# EAGLE design tarjeta-v8 (EAGLE 6.4)
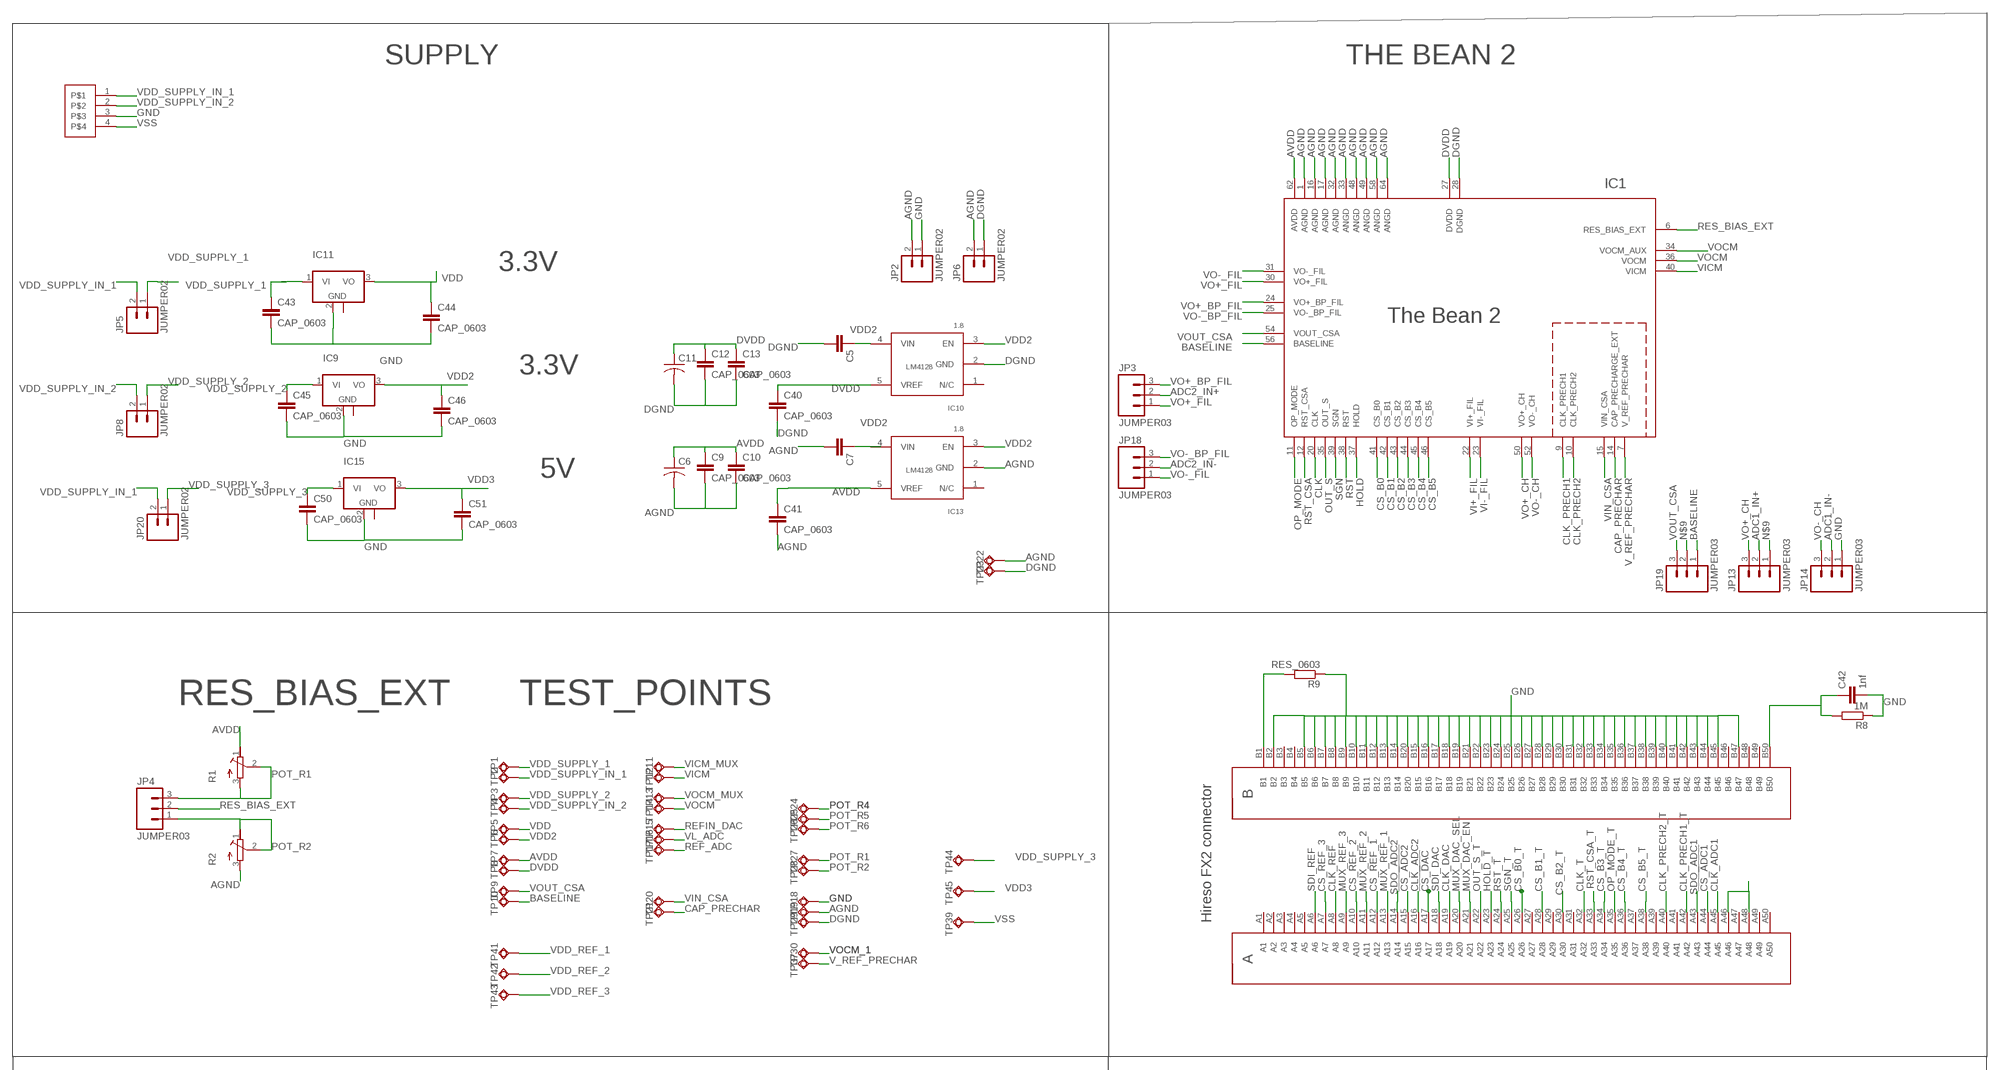
[diagram p0: schematic, sheet 1, part 1 of 3]
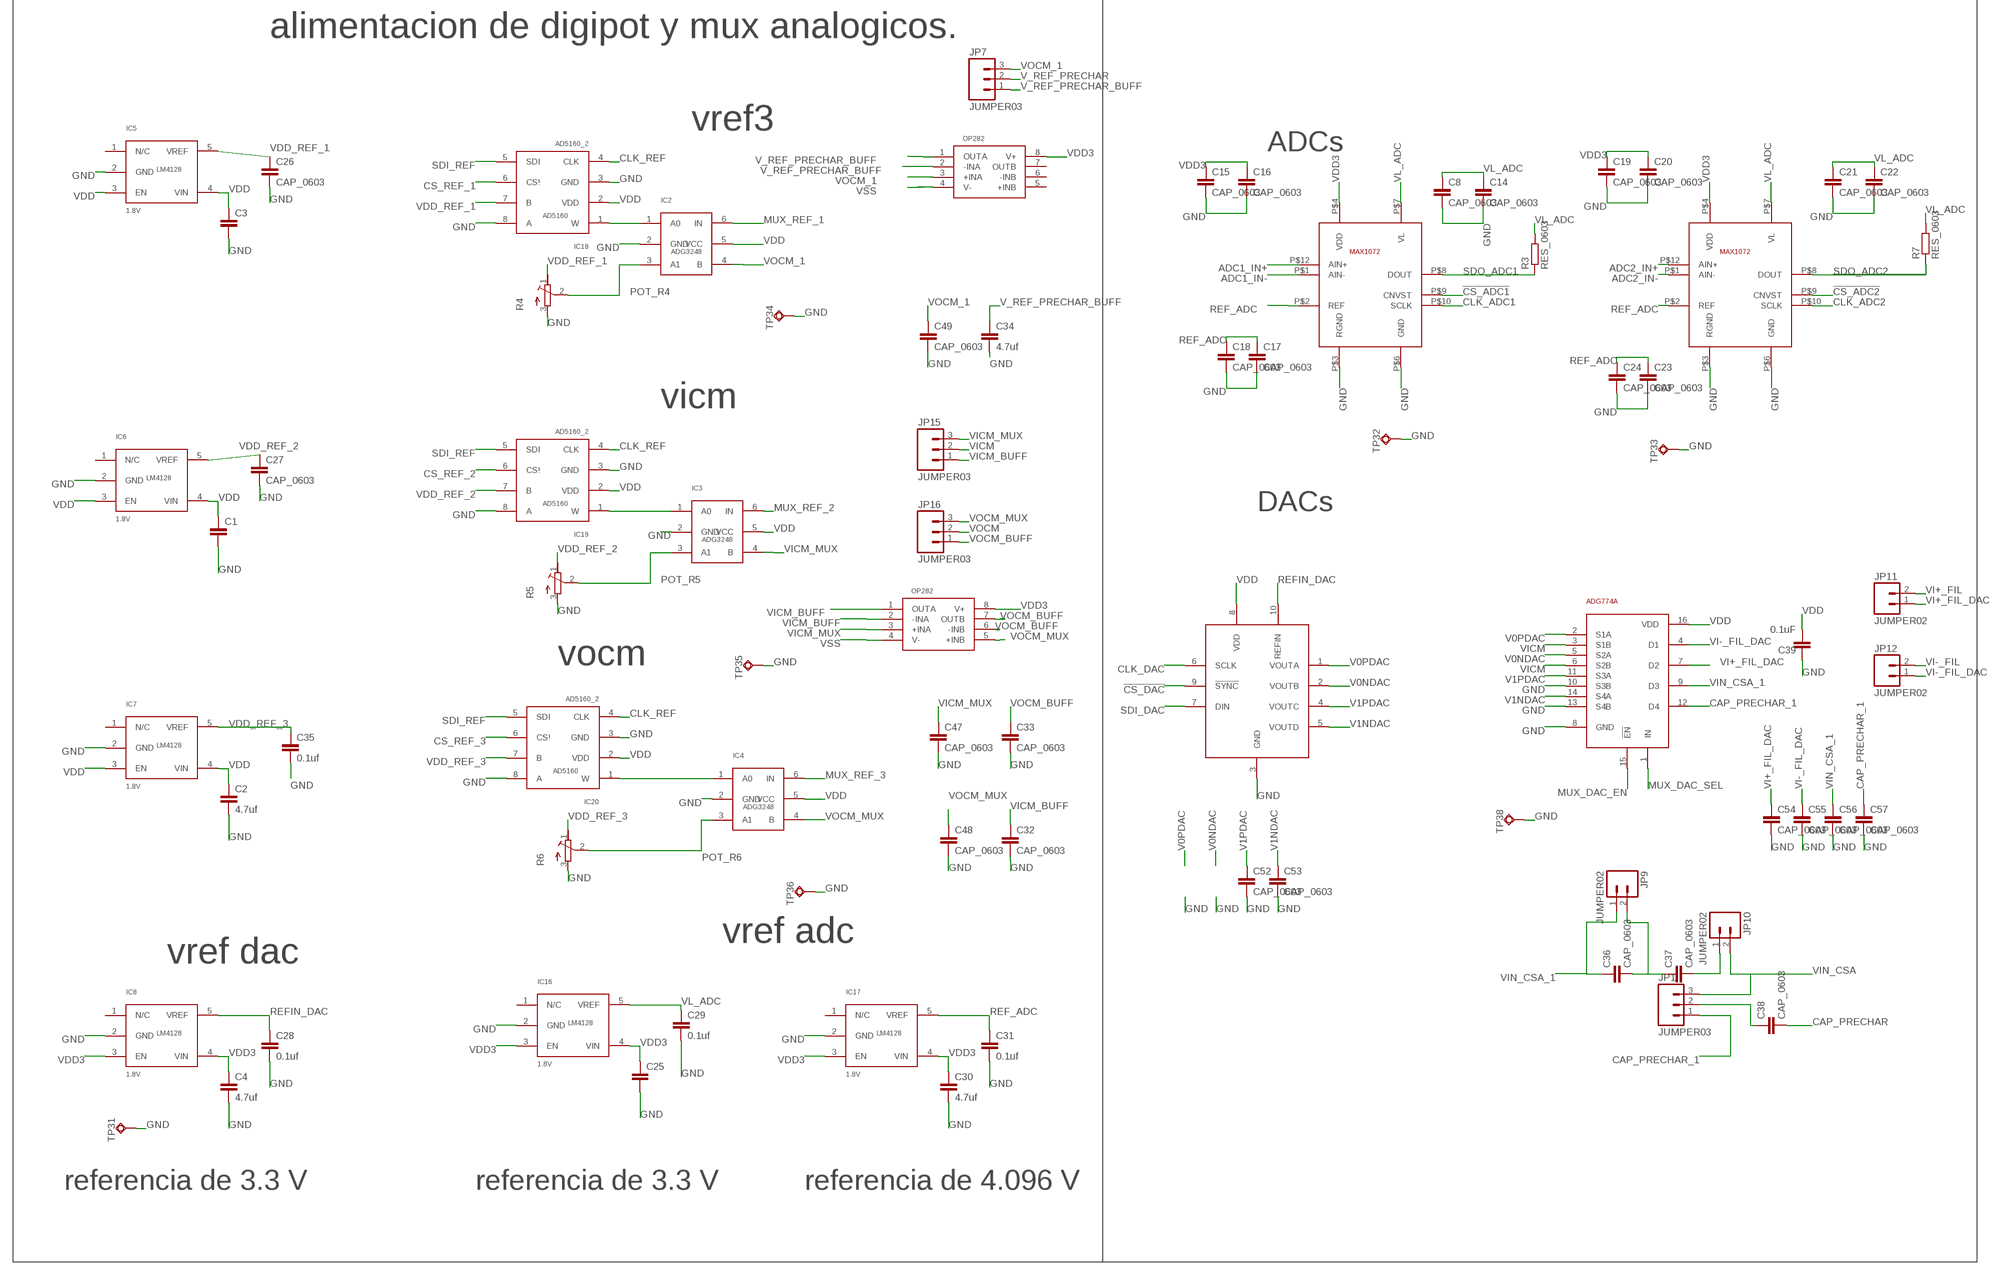
[diagram p1: schematic, sheet 1, part 2 of 3]
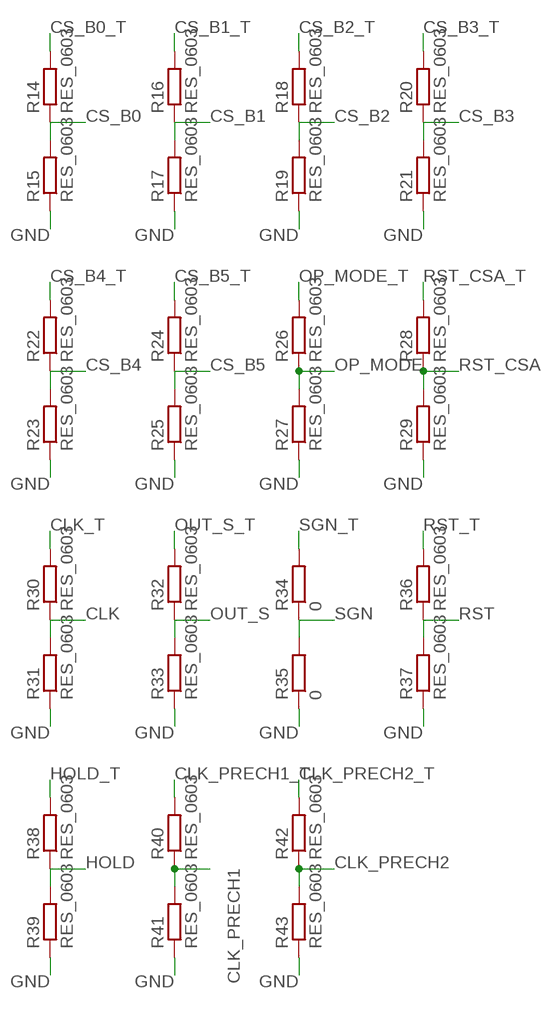
[diagram p2: schematic, sheet 1, part 3 of 3]

## Parts
C1  CAP_0402  [C0402]
C2  4.7uf  CAP_0402  [C0402]
C3  CAP_0402  [C0402]
C4  4.7uf  CAP_0402  [C0402]
C5  CAP_0402  [C0402]
C6  CAP_0805  [C0805]
C7  CAP_0402  [C0402]
C8  CAP_0603  [C0603]
C9  CAP_0603  [C0603]
C10  CAP_0603  [C0603]
C11  CAP_0805  [C0805]
C12  CAP_0603  [C0603]
C13  CAP_0603  [C0603]
C14  CAP_0603  [C0603]
C15  CAP_0603  [C0603]
C16  CAP_0603  [C0603]
C17  CAP_0603  [C0603]
C18  CAP_0603  [C0603]
C19  CAP_0603  [C0603]
C20  CAP_0603  [C0603]
C21  CAP_0603  [C0603]
C22  CAP_0603  [C0603]
C23  CAP_0603  [C0603]
C24  CAP_0603  [C0603]
C25  CAP_0402  [C0402]
C26  CAP_0603  [C0603]
C27  CAP_0603  [C0603]
C28  0.1uf  CAP_0603  [C0603]
C29  0.1uf  CAP_0603  [C0603]
C30  4.7uf  CAP_0402  [C0402]
C31  0.1uf  CAP_0603  [C0603]
C32  CAP_0603  [C0603]
C33  CAP_0603  [C0603]
C34  4.7uf  CAP_0603  [C0603]
C35  0.1uf  CAP_0603  [C0603]
C36  CAP_0603  [C0603]
C37  CAP_0603  [C0603]
C38  CAP_0603  [C0603]
C39  0.1uF  CAP_0603  [C0603]
C40  CAP_0603  [C0603]
C41  CAP_0603  [C0603]
C42  1nf  CAP_0603  [C0603]
C43  CAP_0603  [C0603]
C44  CAP_0603  [C0603]
C45  CAP_0603  [C0603]
C46  CAP_0603  [C0603]
C47  CAP_0603  [C0603]
C48  CAP_0603  [C0603]
C49  CAP_0603  [C0603]
C50  CAP_0603  [C0603]
C51  CAP_0603  [C0603]
C52  CAP_0603  [C0603]
C53  CAP_0603  [C0603]
C54  CAP_0603  [C0603]
C55  CAP_0603  [C0603]
C56  CAP_0603  [C0603]
C57  CAP_0603  [C0603]
IC1  THE_BEAN_2  [QFN64]
IC2  ADG3248  [SC70]
IC3  ADG3248  [SC70]
IC4  ADG3248  [SC70]
IC5  1.8V  LM4128_2  [SOT23-5L_2]
IC6  1.8V  LM4128_2  [SOT23-5L_2]
IC7  1.8V  LM4128_2  [SOT23-5L_2]
IC8  1.8V  LM4128_2  [SOT23-5L_2]
IC9  UA78M33DCY  [SOT223]
IC10  1.8  LM4128_2  [SOT23-5L_2]
IC11  UA78M33DCY  [SOT223]
IC12  OP282  [MSOP8]
IC13  1.8  LM4128_2  [SOT23-5L_2]
IC14  OP282  [MSOP8]
IC15  UA78M33DCY  [SOT223]
IC16  1.8V  LM4128_2  [SOT23-5L_2]
IC17  1.8V  LM4128_2  [SOT23-5L_2]
IC18  AD5160_2  [SOT23-8_2]
IC19  AD5160_2  [SOT23-8_2]
IC20  AD5160_2  [SOT23-8_2]
IC21  ADG774A  [QSOP16]
IC22  MAX1072  [TQFN12]
IC23  DAC7554  [MSOP10]
J1  HIRESO_FX_CONNECTOR  [FX2-100S-1.27]
JP1  JUMPER03  [1X03]
JP2  JUMPER02  [1X02]
JP3  JUMPER03  [1X03]
JP4  JUMPER03  [1X03]
JP5  JUMPER02  [1X02]
JP6  JUMPER02  [1X02]
JP7  JUMPER03  [1X03]
JP8  JUMPER02  [1X02]
JP9  JUMPER02  [1X02]
JP10  JUMPER02  [1X02]
JP11  JUMPER02  [1X02]
JP12  JUMPER02  [1X02]
JP13  JUMPER03  [1X03]
JP14  JUMPER03  [1X03]
JP15  JUMPER03  [1X03]
JP16  JUMPER03  [1X03]
JP17  JUMPER04  [1X04]
JP18  JUMPER03  [1X03]
JP19  JUMPER03  [1X03]
JP20  JUMPER02  [1X02]
R1  TRIMMER_ST5  [ST-5EW]
R2  TRIMMER_ST5  [ST-5EW]
R3  RES_0603  [R0603]
R4  TRIMMER_ST5  [ST-5EW]
R5  TRIMMER_ST5  [ST-5EW]
R6  TRIMMER_ST5  [ST-5EW]
R7  RES_0603  [R0603]
R8  1M  RES_0603  [R0603]
R9  RES_0603  [R0603]
R14  RES_0603  [R0603]
R15  RES_0603  [R0603]
R16  RES_0603  [R0603]
R17  RES_0603  [R0603]
R18  RES_0603  [R0603]
R19  RES_0603  [R0603]
R20  RES_0603  [R0603]
R21  RES_0603  [R0603]
R22  RES_0603  [R0603]
R23  RES_0603  [R0603]
R24  RES_0603  [R0603]
R25  RES_0603  [R0603]
R26  RES_0603  [R0603]
R27  RES_0603  [R0603]
R28  RES_0603  [R0603]
R29  RES_0603  [R0603]
R30  RES_0603  [R0603]
R31  RES_0603  [R0603]
R32  RES_0603  [R0603]
R33  RES_0603  [R0603]
R34  0  RES_0603  [R0603]
R35  0  RES_0603  [R0603]
R36  RES_0603  [R0603]
R37  RES_0603  [R0603]
R38  RES_0603  [R0603]
R39  RES_0603  [R0603]
R40  RES_0603  [R0603]
R41  RES_0603  [R0603]
R42  RES_0603  [R0603]
R43  RES_0603  [R0603]
TP1  TEST_POINT  [TP]
TP2  TEST_POINT  [TP]
TP3  TEST_POINT  [TP]
TP4  TEST_POINT  [TP]
TP5  TEST_POINT  [TP]
TP6  TEST_POINT  [TP]
TP7  TEST_POINT  [TP]
TP8  TEST_POINT  [TP]
TP9  TEST_POINT  [TP]
TP10  TEST_POINT  [TP]
TP11  TEST_POINT  [TP]
TP12  TEST_POINT  [TP]
TP13  TEST_POINT  [TP]
TP14  TEST_POINT  [TP]
TP15  TEST_POINT  [TP]
TP16  TEST_POINT  [TP]
TP17  TEST_POINT  [TP]
TP18  TEST_POINT  [TP]
TP19  TEST_POINT  [TP]
TP20  TEST_POINT  [TP]
TP21  TEST_POINT  [TP]
TP22  TEST_POINT  [TP]
TP23  TEST_POINT  [TP]
TP24  TEST_POINT  [TP]
TP25  TEST_POINT  [TP]
TP26  TEST_POINT  [TP]
TP27  TEST_POINT  [TP]
TP28  TEST_POINT  [TP]
TP29  TEST_POINT  [TP]
TP30  TEST_POINT  [TP]
TP31  TEST_POINT  [TP]
TP32  TEST_POINT  [TP]
TP33  TEST_POINT  [TP]
TP34  TEST_POINT  [TP]
TP35  TEST_POINT  [TP]
TP36  TEST_POINT  [TP]
TP37  TEST_POINT  [TP]
TP38  TEST_POINT  [TP]
TP39  TEST_POINT  [TP]
TP41  TEST_POINT  [TP]
TP42  TEST_POINT  [TP]
TP43  TEST_POINT  [TP]
TP44  TEST_POINT  [TP]
TP45  TEST_POINT  [TP]
U$5  MAX1072  [TQFN12]

## Nets
!CS_ADC1: IC22.P$9(CNVST) J1.A44
!CS_ADC2: J1.A15 U$5.P$9(CNVST)
!CS_DAC: IC23.9(!SYNC) J1.A17
ADC1_IN+: IC22.P$12(AIN+) JP13.2
ADC1_IN-: IC22.P$1(AIN-) JP14.2
ADC2_IN+: JP3.2 U$5.P$12(AIN+)
ADC2_IN-: JP18.2 U$5.P$1(AIN-)
AGND: C6.2 C7.2 C9.2 C10.2 C41.2 IC1.1(AGND) IC1.16(AGND) IC1.17(AGND) IC1.32(AGND) IC1.33(ANGD) IC1.48(ANGD) IC1.49(ANGD) IC1.58(ANGD) IC1.64(ANGD) IC13.2(GND) JP2.2 JP6.2 R2.3 TP19.TP TP22.TP
AVDD: C6.1 C9.1 C10.1 C41.1 IC1.62(AVDD) IC13.5(VREF) R1.1 TP7.TP
BASELINE: IC1.56(BASELINE) JP19.1 TP10.TP
CAP_PRECHAR: C38.2 IC1.14(CAP_PRECHARGE_EXT) TP21.TP
CAP_PRECHAR_1: C57.1 IC21.12(D4) JP1.1
CLK: IC1.20(CLK) R30.1 R31.2
CLK_ADC1: IC22.P$10(SCLK) J1.A45
CLK_ADC2: J1.A16 U$5.P$10(SCLK)
CLK_DAC: IC23.6(SCLK) J1.A19
CLK_PRECH1: IC1.9(CLK_PRECH1) R40.1 R41.2
CLK_PRECH1_T: J1.A42 R40.2
CLK_PRECH2: IC1.10(CLK_PRECH2) R42.1 R43.2
CLK_PRECH2_T: J1.A40 R42.2
CLK_REF: IC18.4(CLK) IC19.4(CLK) IC20.4(CLK) J1.A8
CLK_T: J1.A32 R30.2
CS_B0: IC1.41(CS_B0) R14.1 R15.2
CS_B0_T: J1.A26 R14.2
CS_B1: IC1.42(CS_B1) R16.1 R17.2
CS_B1_T: J1.A28 R16.2
CS_B2: IC1.43(CS_B2) R18.1 R19.2
CS_B2_T: J1.A30 R18.2
CS_B3: IC1.44(CS_B3) R20.1 R21.2
CS_B3_T: J1.A34 R20.2
CS_B4: IC1.45(CS_B4) R22.1 R23.2
CS_B4_T: J1.A36 R22.2
CS_B5: IC1.46(CS_B5) R24.1 R25.2
CS_B5_T: J1.A38 R24.2
CS_REF_1: IC18.6(CS!) J1.A12
CS_REF_2: IC19.6(CS!) J1.A10
CS_REF_3: IC20.6(CS!) J1.A7
DGND: C5.2 C11.2 C12.2 C13.2 C40.2 IC1.28(DGND) IC10.2(GND) JP6.1 TP23.TP TP29.TP
DVDD: C11.1 C12.1 C13.1 C40.1 IC1.27(DVDD) IC10.5(VREF) TP8.TP
GND: C1.2 C2.2 C3.2 C4.2 C8.2 C14.2 C15.2 C16.2 C17.2 C18.2 C19.2 C20.2 C21.2 C22.2 C23.2 C24.2 C25.2 C26.2 C27.2 C28.2 C29.2 C30.2 C31.2 C32.2 C33.2 C34.2 C35.2 C39.1 C42.2 C43.2 C44.2 C45.2 C46.2 C47.2 C48.2 C49.2 C50.2 C51.2 C52.2 C53.2 C54.2 C55.2 C56.2 C57.2 IC2.2(GND) IC3.2(GND) IC4.2(GND) IC5.2(GND) IC6.2(GND) IC7.2(GND) IC8.2(GND) IC9.2(GND) IC11.2(GND) IC15.2(GND) IC16.2(GND) IC17.2(GND) IC18.3(GND) IC18.8(A) IC19.3(GND) IC19.8(A) IC20.3(GND) IC20.8(A) IC21.8(GND) IC21.10(S3B) IC21.13(S4B) IC22.P$3(RGND) IC22.P$6(GND) IC23.3(GND) J1.B2 J1.B5 J1.B6 J1.B7 J1.B8 J1.B9 J1.B10 J1.B11 J1.B12 J1.B13 J1.B14 J1.B15 J1.B16 J1.B17 J1.B18 J1.B19 J1.B20 J1.B21 J1.B22 J1.B23 J1.B24 J1.B25 J1.B26 J1.B27 J1.B28 J1.B29 J1.B30 J1.B31 J1.B32 J1.B33 J1.B34 J1.B35 J1.B36 J1.B37 J1.B38 J1.B39 J1.B40 J1.B41 J1.B42 J1.B43 J1.B44 J1.B45 J1.B47 JP2.1 JP14.1 JP17.3 R4.3 R5.3 R6.3 R8.1 R9.1 R15.1 R17.1 R19.1 R21.1 R23.1 R25.1 R27.1 R29.1 R31.1 R33.1 R35.1 R37.1 R39.1 R41.1 R43.1 TP18.TP TP31.TP TP32.TP TP33.TP TP34.TP TP35.TP TP36.TP TP38.TP U$5.P$3(RGND) U$5.P$6(GND)
HOLD: IC1.37(HOLD) R38.1 R39.2
HOLD_T: J1.A23 R38.2
MUX_DAC_EN: IC21.15(!EN) J1.A21
MUX_DAC_SEL: IC21.1(IN) J1.A20
MUX_REF_1: IC2.6(IN) J1.A13
MUX_REF_2: IC3.6(IN) J1.A11
MUX_REF_3: IC4.6(IN) J1.A9
N$1: C36.2 C37.1 JP9.2
N$2: J1.B1 R9.2
N$3: C37.2 JP10.1
N$4: J1.A46 J1.A48
N$5: IC4.1(A0) IC20.1(W)
N$6: C38.1 JP1.2
N$9: JP13.1 JP19.2
N$10: C42.1 J1.B50 R8.2
N$17: IC2.1(A0) IC18.1(W)
N$19: IC3.1(A0) IC19.1(W)
OP_MODE: IC1.11(OP_MODE) R26.1 R27.2
OP_MODE_T: J1.A35 R26.2
OUT_S: IC1.35(OUT_S) R32.1 R33.2
OUT_S_T: J1.A22 R32.2
POT_R1: JP4.3 R1.2 R1.3 TP27.TP
POT_R2: JP4.1 R2.1 R2.2 TP28.TP
POT_R4: IC2.3(A1) R4.2 TP24.TP
POT_R5: IC3.3(A1) R5.2 TP25.TP
POT_R6: IC4.3(A1) R6.2 TP26.TP
REF_ADC: C17.1 C18.1 C23.1 C24.1 C31.1 IC17.5(VREF) IC22.P$2(REF) TP17.TP U$5.P$2(REF)
REFIN_DAC: C28.1 IC8.5(VREF) IC23.10(REFIN) TP15.TP
RES_BIAS_EXT: IC1.6(RES_BIAS_EXT) JP4.2
RST: IC1.38(RST) R36.1 R37.2
RST_CSA: IC1.12(RST_CSA) R28.1 R29.2
RST_CSA_T: J1.A33 R28.2
RST_T: J1.A24 R36.2
SDI_DAC: IC23.7(DIN) J1.A18
SDI_REF: IC18.5(SDI) IC19.5(SDI) IC20.5(SDI) J1.A6
SDO_ADC1: IC22.P$8(DOUT) J1.A43 R3.1
SDO_ADC2: J1.A14 R7.1 U$5.P$8(DOUT)
SGN: IC1.39(SGN) R34.1 R35.2
SGN_T: J1.A25 R34.2
V0NDAC: IC21.5(S2A) IC23.2(VOUTB)
V0PDAC: IC21.2(S1A) IC23.1(VOUTA)
V1NDAC: C53.1 IC21.14(S4A) IC23.5(VOUTD)
V1PDAC: C52.1 IC21.11(S3A) IC23.4(VOUTC)
V_REF_PRECHAR: IC1.7(V_REF_PRECHAR) JP7.2 TP37.TP
V_REF_PRECHAR_BUFF: C34.1 IC14.1(OUTA) IC14.2(-INA) JP7.1
VDD: C1.1 C2.1 C3.1 C39.2 C44.1 IC2.5(VCC) IC3.5(VCC) IC4.5(VCC) IC5.3(EN) IC5.4(VIN) IC6.3(EN) IC6.4(VIN) IC7.3(EN) IC7.4(VIN) IC11.3(VO) IC18.2(VDD) IC19.2(VDD) IC20.2(VDD) IC21.16(VDD) IC23.8(VDD) TP5.TP
VDD2: C5.1 C7.1 C46.1 IC9.3(VO) IC10.3(EN) IC10.4(VIN) IC13.3(EN) IC13.4(VIN) TP6.TP
VDD3: C4.1 C15.1 C16.1 C19.1 C20.1 C25.1 C30.1 C51.1 IC8.3(EN) IC8.4(VIN) IC12.8(V+) IC14.8(V+) IC15.3(VO) IC16.3(EN) IC16.4(VIN) IC17.3(EN) IC17.4(VIN) IC22.P$4(VDD) TP45.TP U$5.P$4(VDD)
VDD_REF_1: C26.1 IC5.5(VREF) IC18.7(B) R4.1 TP41.TP
VDD_REF_2: C27.1 IC6.5(VREF) IC19.7(B) R5.1 TP42.TP
VDD_REF_3: C35.1 IC7.5(VREF) IC20.7(B) R6.1 TP43.TP
VDD_SUPPLY_1: C43.1 IC11.1(VI) JP5.1 TP1.TP
VDD_SUPPLY_2: C45.1 IC9.1(VI) JP8.1 TP3.TP
VDD_SUPPLY_3: C50.1 IC15.1(VI) JP20.1 TP44.TP
VDD_SUPPLY_IN_1: JP5.2 JP17.1 JP20.2 TP2.TP
VDD_SUPPLY_IN_2: JP8.2 JP17.2 TP4.TP
VI+_FIL: IC1.22(VI+_FIL) JP11.2
VI+_FIL_DAC: C54.1 IC21.4(D1) JP11.1
VI-_FIL: IC1.23(VI-_FIL) JP12.2
VI-_FIL_DAC: C55.1 IC21.7(D2) JP12.1
VICM: IC1.40(VICM) IC21.3(S1B) IC21.6(S2B) JP15.2 TP12.TP
VICM_BUFF: C32.1 IC12.1(OUTA) IC12.2(-INA) JP15.1
VICM_MUX: C47.1 IC3.4(B) IC12.3(+INA) JP15.3 TP11.TP
VIN_CSA: IC1.15(VIN_CSA) JP1.3 JP10.2 TP20.TP
VIN_CSA_1: C36.1 C56.1 IC21.9(D3) JP9.1
VL_ADC: C8.1 C14.1 C21.1 C22.1 C29.1 IC16.5(VREF) IC22.P$7(VL) R3.2 R7.2 TP16.TP U$5.P$7(VL)
VO+_BP_FIL: IC1.24(VO+_BP_FIL) JP3.3
VO+_CH: IC1.50(VO+_CH) JP13.3
VO+_FIL: IC1.30(VO+_FIL) JP3.1
VO-_BP_FIL: IC1.25(VO-_BP_FIL) JP18.3
VO-_CH: IC1.52(VO-_CH) JP14.3
VO-_FIL: IC1.31(VO-_FIL) JP18.1
VOCM: IC1.34(VOCM_AUX) IC1.36(VOCM) JP16.2 TP14.TP
VOCM_1: C49.1 IC2.4(B) IC14.3(+INA) JP7.3 TP30.TP
VOCM_BUFF: C33.1 IC12.6(-INB) IC12.7(OUTB) JP16.1
VOCM_MUX: C48.1 IC4.4(B) IC12.5(+INB) JP16.3 TP13.TP
VOUT_CSA: IC1.54(VOUT_CSA) JP19.3 TP9.TP
VSS: IC12.4(V-) IC14.4(V-) JP17.4 TP39.TP
Unconnected: IC5.1(N/C) IC6.1(N/C) IC7.1(N/C) IC8.1(N/C) IC9.4(GND) IC10.1(N/C) IC11.4(GND) IC13.1(N/C) IC14.5(+INB) IC14.6(-INB) IC14.7(OUTB) IC15.4(GND) IC16.1(N/C) IC17.1(N/C) J1.A1 J1.A2 J1.A3 J1.A4 J1.A5 J1.A27 J1.A29 J1.A31 J1.A37 J1.A39 J1.A41 J1.A47 J1.A49 J1.A50 J1.B3 J1.B4 J1.B46 J1.B48 J1.B49

## Notes on the sheet
- SUPPLY | THE BEAN 2
- 3.3V
- 3.3V
- 5V
- RES_BIAS_EXT | TEST_POINTS
- alimentacion de digipot y mux analogicos.
- vref3
- ADCs
- vicm
- DACs
- vocm
- vref adc
- vref dac
- referencia de 3.3 V | referencia de 3.3 V | referencia de 4.096 V

## Library data of the parts
C1-C5 C7 C25 C30 = wac:CAP_0402
C6 C11 = wac:CAP_0805
C8-C10 C12-C24 C26-C29 C31-C57 = wac:CAP_0603
IC1 = wac:THE_BEAN_2
IC2-IC4 = wac:ADG3248
IC5-IC8 IC10 IC13 IC16 IC17 = wac:LM4128_2
IC9 IC11 IC15 = linear:UA78M*: POSITIVE-VOLTAGE REGULATORS Source: http://focus.ti.com/lit/ds/symlink/ua78m33.pdf
IC12 IC14 = wac:OP282: OP282. Package:8-lead MSOP. Obtenido desde http://www.analog.com/media/en/technical-documentation/data-sheets/OP282_482.pdf
IC18-IC20 = wac:AD5160_2
IC21 = wac:ADG774A: Low voltage,400MHz, Quad 2:1 MUX with 3ns Switching Time http://www.analog.com/static/imported-files/data_sheets/ADG774A.pdf
IC22 U$5 = wac:MAX1072
IC23 = wac:DAC7554: 12-BIT, QUAD, ULTRALOW GLITCH, VOLTAGE OUTPUT DIGITAL-TO-ANALOG CONVERTER http://www.ti.com/lit/ds/symlink/dac7554.pdf
J1 = wac:HIRESO_FX_CONNECTOR: Conector Hireso de la serie FX2. Part Number: FX2-100S-1.27DS(L)
JP1 JP3 JP4 JP7 JP13-JP16 JP18 JP19 = wac:JUMPER03
JP2 JP5 JP6 JP8-JP12 JP20 = wac:JUMPER02
JP17 = wac:JUMPER04
R1 R2 R4-R6 = wac:TRIMMER_ST5
R3 R7-R9 R14-R43 = wac:RES_0603
TP1-TP39 TP41-TP45 = wac:TEST_POINT

## Board
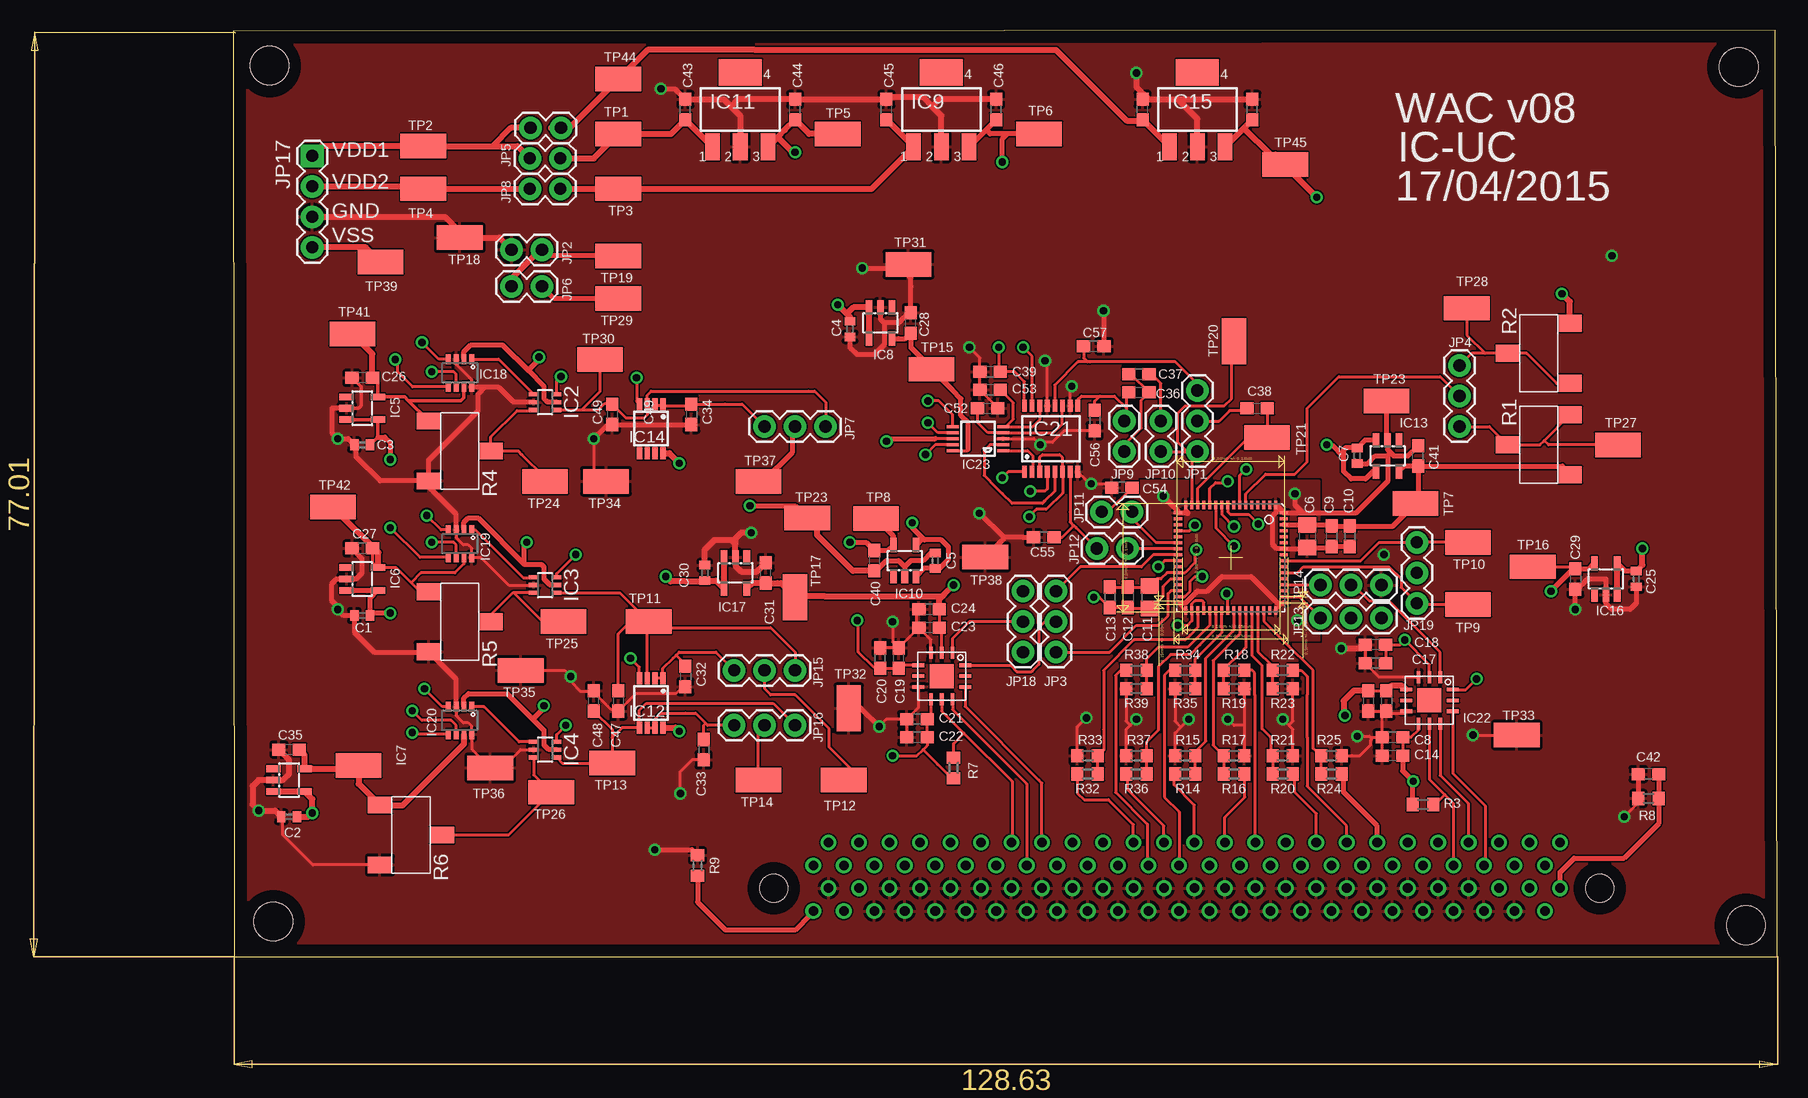
[diagram p3: board, top side]
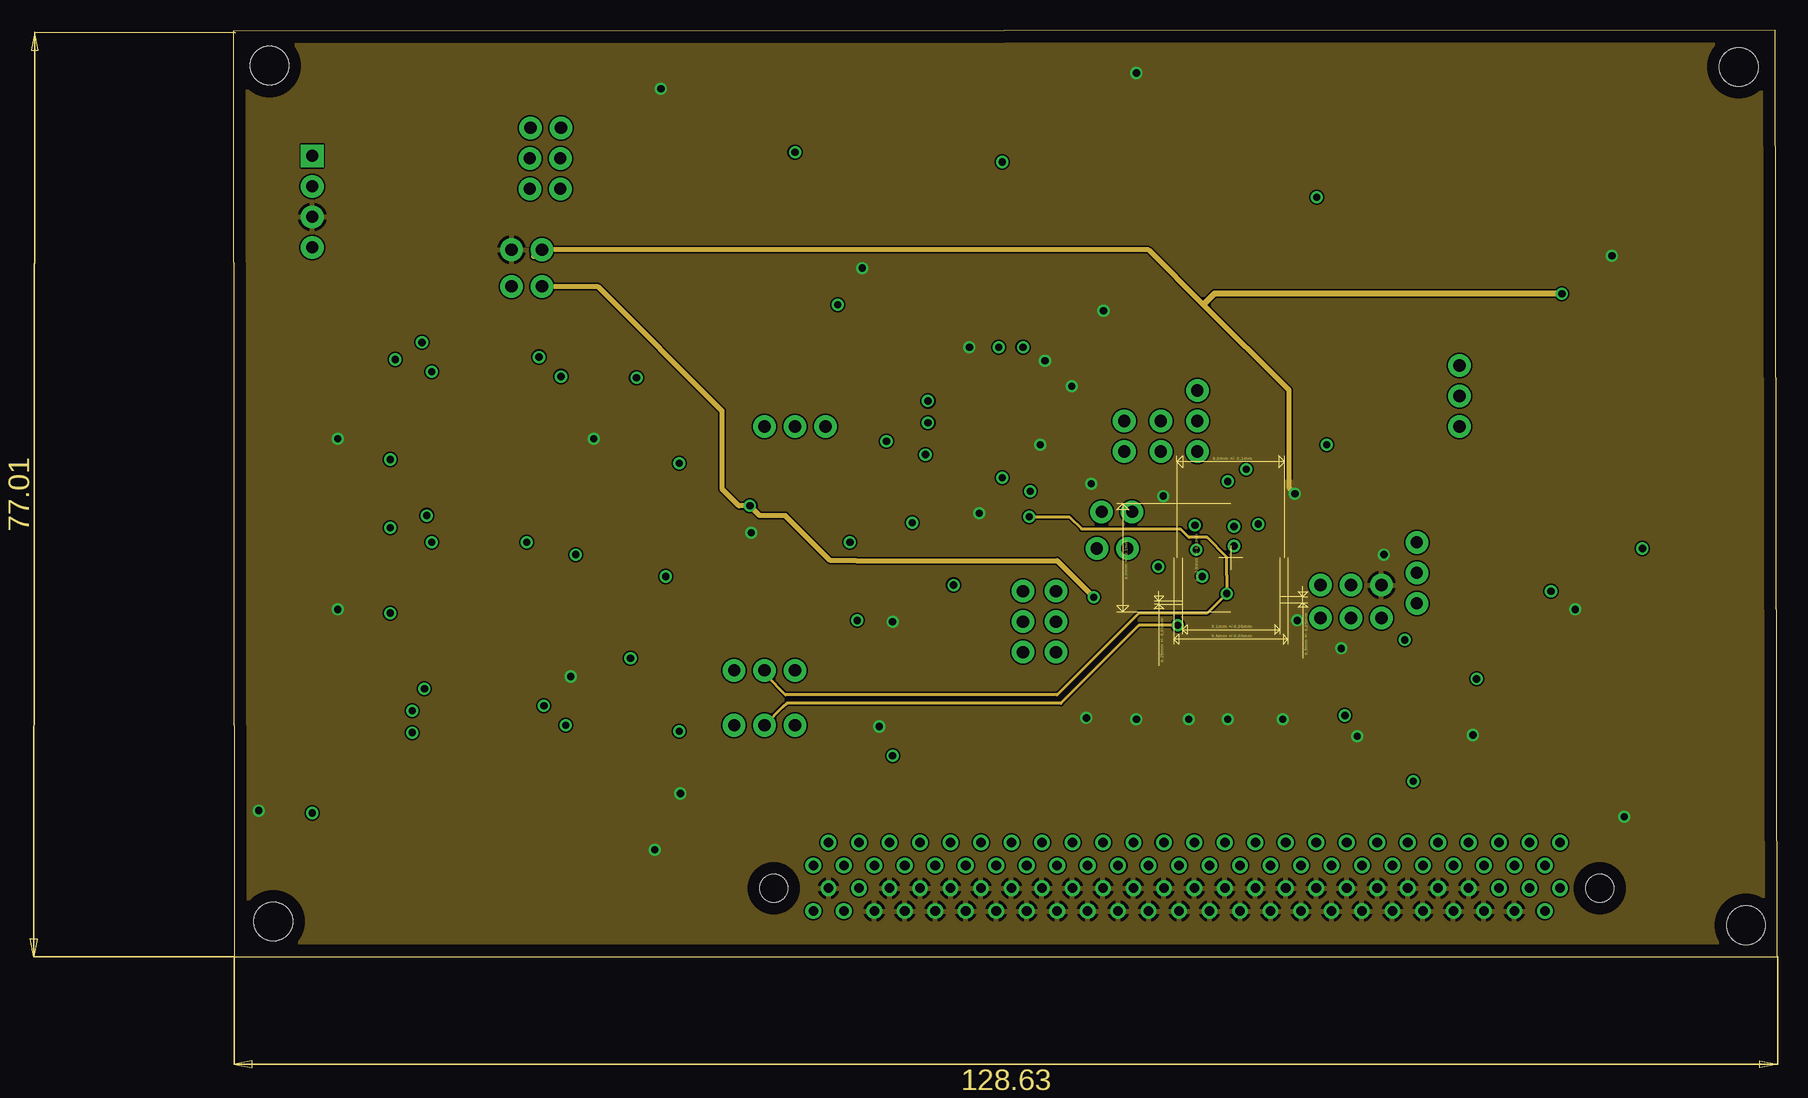
[diagram p4: board, inner layer Route2]
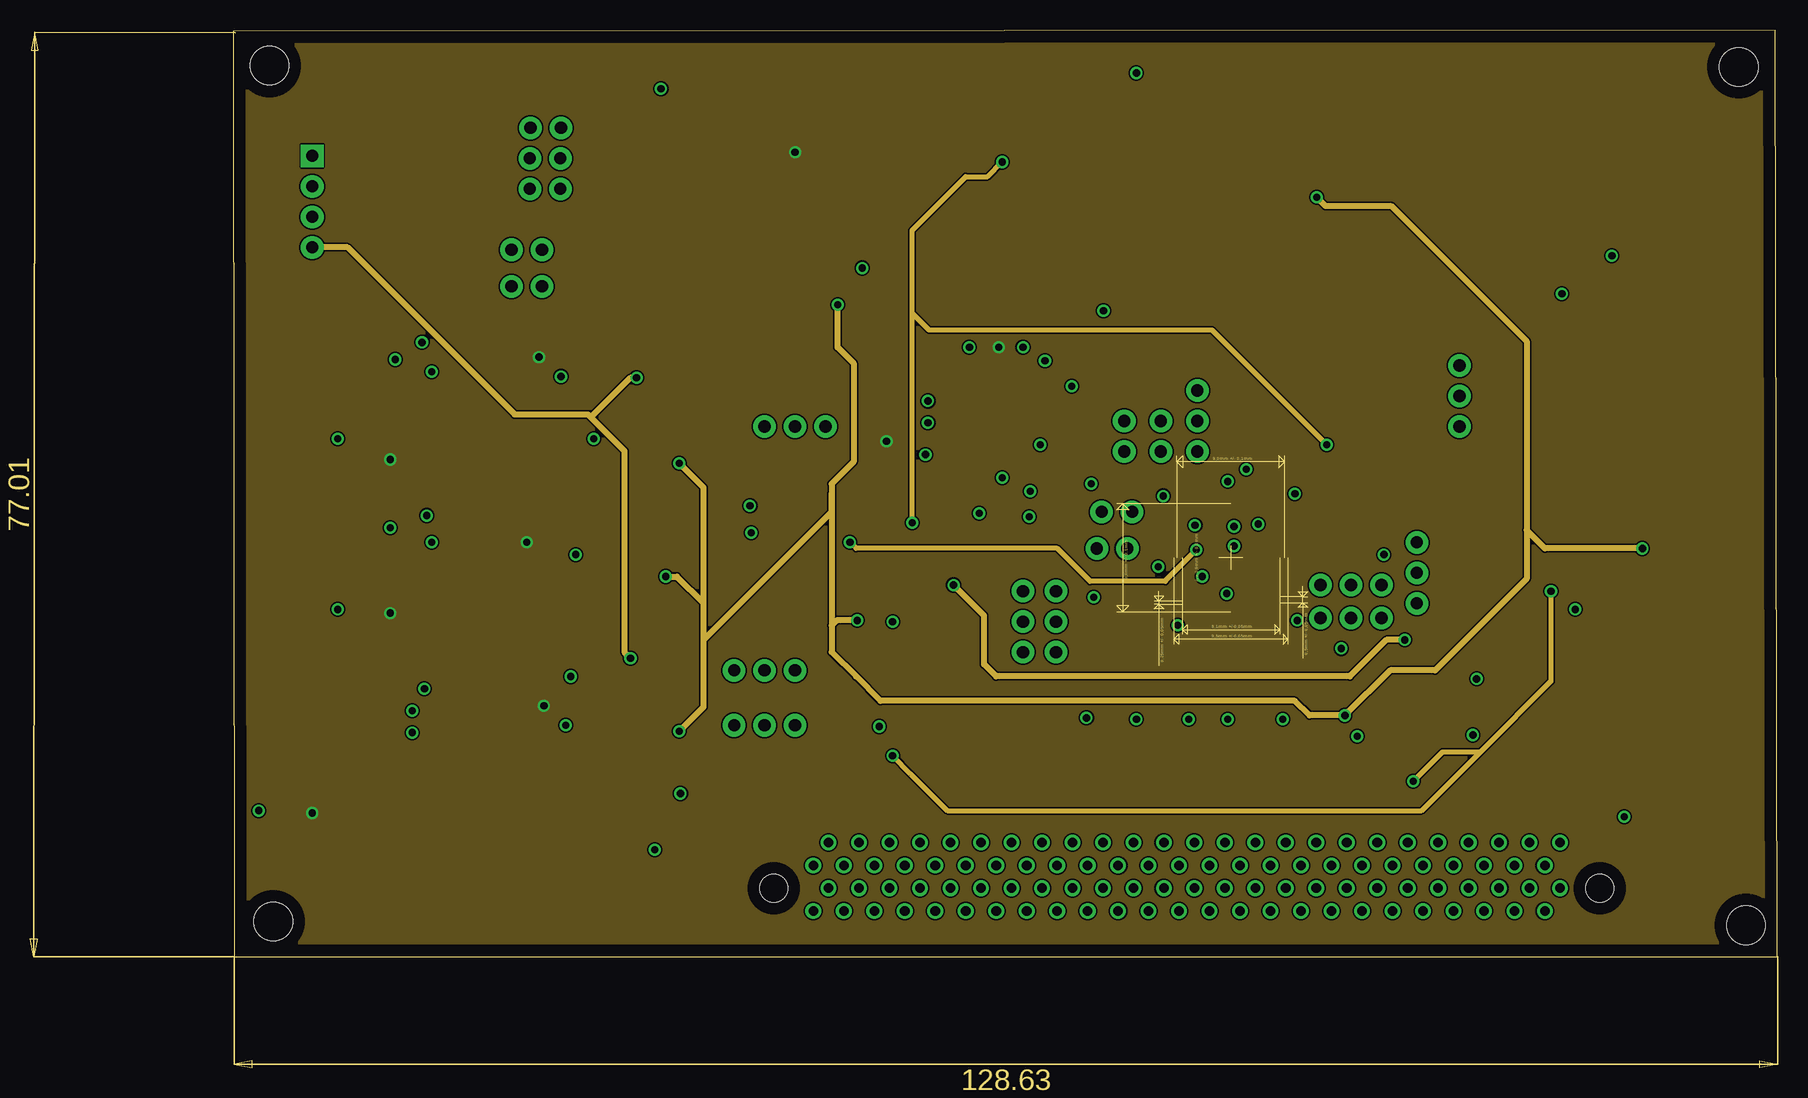
[diagram p5: board, inner layer Route3]
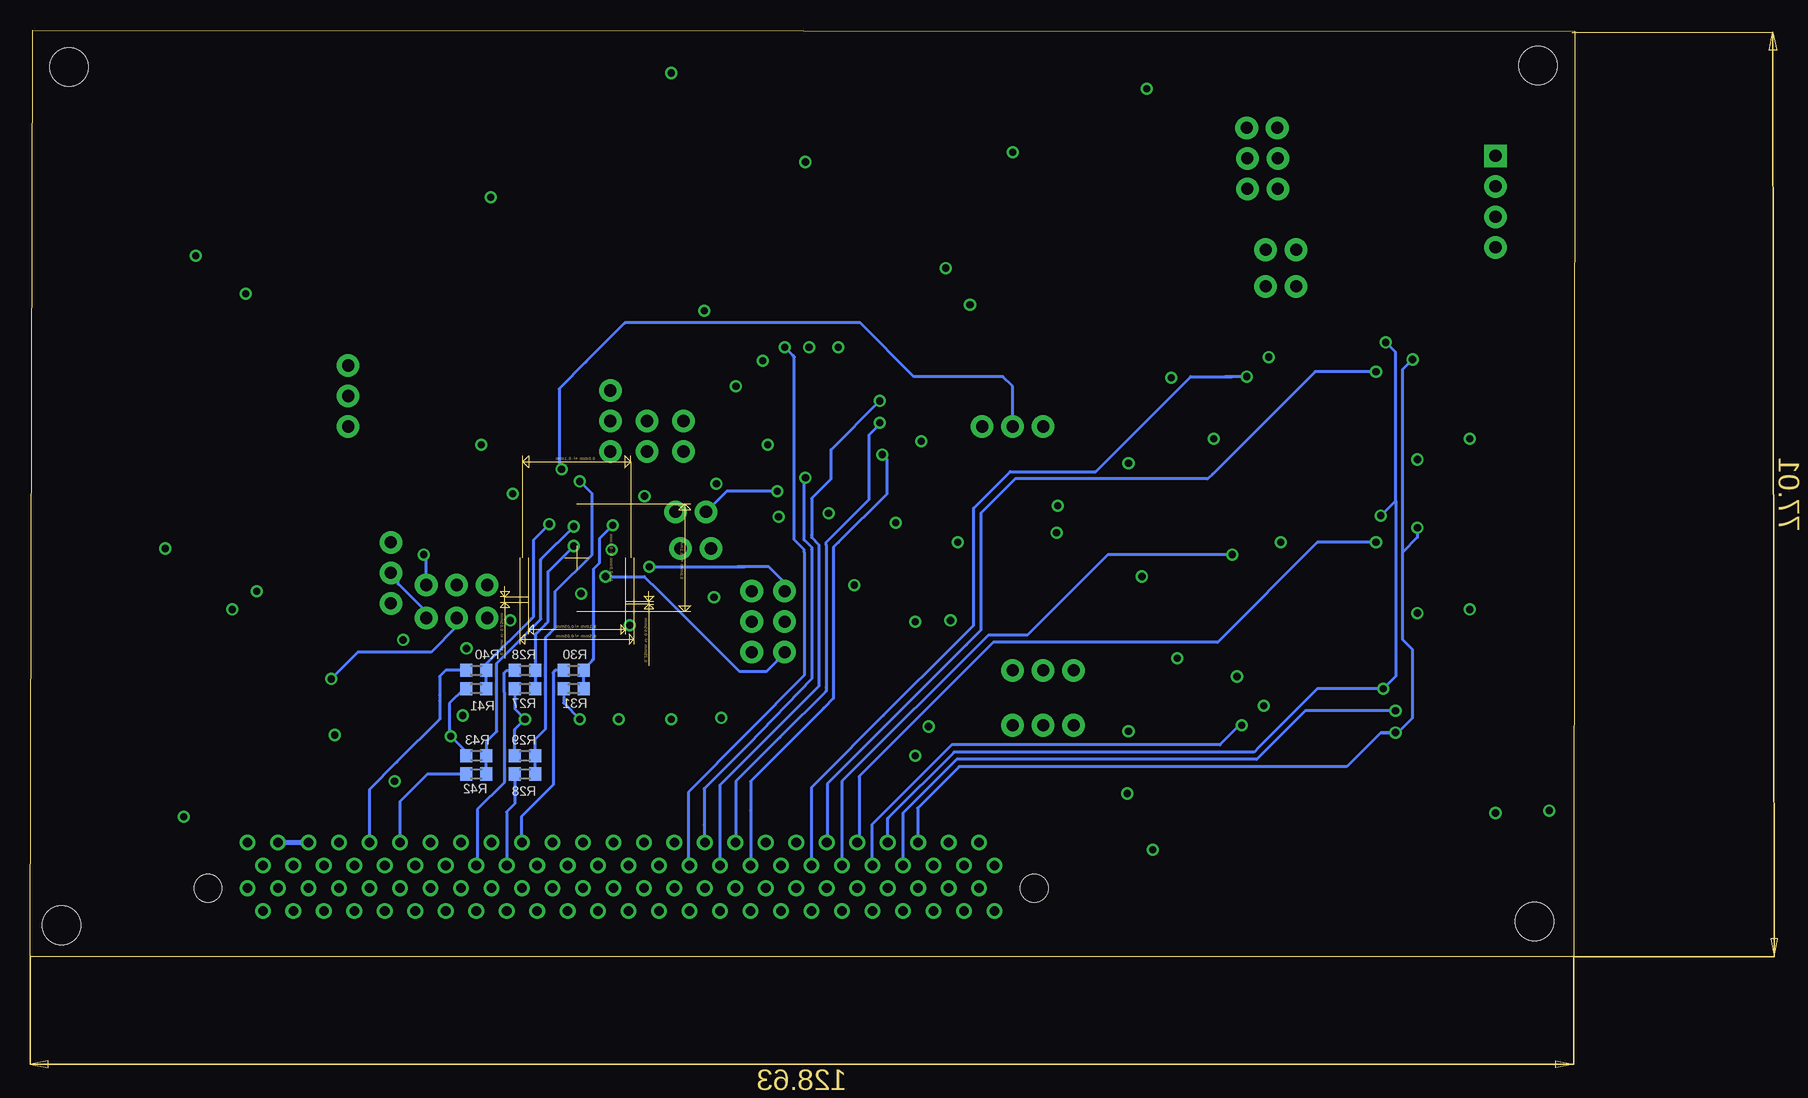
[diagram p6: board, bottom side, seen from below]

Size 128.71 x 77.24 mm. Coordinates in mm from the lower left corner, seen from the top.
Outline: 0.1,0 128.71,0 128.5,77.24 0,77.14 0.1,0
Copper layers [2:(1*2*3*16):3]: Top 0.035mm / dielectric 0.2mm / Route2 0.035mm / dielectric 0.15mm / Route3 0.035mm / dielectric 0.2mm / Bottom 0.035mm
Design rules "default *": minimum track width 10mil, minimum drill 24mil, track to track 5mil, track to pad 5mil, pad to pad 5mil, via to via 5mil, smd to smd 5mil, copper to edge 40mil, drill to drill 8mil, minimum pad ring 10mil, minimum via ring 8mil, stop-mask expansion 4mil, vias tented up to drill 0mil, thermal gap 10mil
Holes 3.2 mm at 3.35,2.95 126.09,2.64 3.05,74.27 125.48,74.17

### Footprints (pad centres in the part's own frame; a part is rotated, then mirrored left to right if it is on the bottom)
C0402 = smd 0.7 x 0.9: 1 -0.65,0; 2 0.65,0
C0805 = smd 1.3 x 1.5: 1 -0.95,0; 2 0.95,0
C0603 = smd 1.1 x 1: 1 -0.85,0; 2 0.85,0
QFN64 = smd 0.7 x 0.25: 1 -14.56,5.02; 2 -14.56,4.52; 3 -14.56,4.02; 4 -14.56,3.52; 5 -14.56,3.02; 6 -14.56,2.52; 7 -14.56,2.02; 8 -14.56,1.52; 9 -14.56,1.02; 10 -14.56,0.52; 11 -14.56,0.02; 12 -14.56,-0.48; 13 -14.56,-0.98; 14 -14.56,-1.48; 15 -14.56,-1.98; 16 -14.56,-2.48; 33 -5.76,-2.48; 34 -5.76,-1.98; 35 -5.76,-1.48; 36 -5.76,-0.98; 37 -5.76,-0.48; 38 -5.76,0.02; 39 -5.76,0.52; 40 -5.76,1.02; 41 -5.76,1.52; 42 -5.76,2.02; 43 -5.76,2.52; 44 -5.76,3.02; 45 -5.76,3.52; 46 -5.76,4.02; 47 -5.76,4.52; 48 -5.76,5.02 | smd 0.25 x 0.7: 17 -13.91,-3.13; 18 -13.41,-3.13; 19 -12.91,-3.13; 20 -12.41,-3.13; 21 -11.91,-3.13; 22 -11.41,-3.13; 23 -10.91,-3.13; 24 -10.41,-3.13; 25 -9.91,-3.13; 26 -9.41,-3.13; 27 -8.91,-3.13; 28 -8.41,-3.13; 29 -7.91,-3.13; 30 -7.41,-3.13; 31 -6.91,-3.13; 32 -6.41,-3.13; 49 -6.41,5.67; 50 -6.91,5.67; 51 -7.41,5.67; 52 -7.91,5.67; 53 -8.41,5.67; 54 -8.91,5.67; 55 -9.41,5.67; 56 -9.91,5.67; 57 -10.41,5.67; 58 -10.91,5.67; 59 -11.41,5.67; 60 -11.91,5.67; 61 -12.41,5.67; 62 -12.91,5.67; 63 -13.41,5.67; 64 -13.91,5.67
SC70 = smd 0.35 x 0.8: 1 -0.65,-0.95; 2 0,-0.95; 3 0.65,-0.95; 4 0.65,0.95; 5 0,0.95; 6 -0.65,0.95
SOT23-5L_2 = smd 0.55 x 1.2: 1 -0.95,-1.3; 2 0,-1.3; 3 0.95,-1.3; 4 0.95,1.3; 5 -0.95,1.3
SOT223 = smd 1.219 x 2.235: 1 -2.311,-3.099; 2 0,-3.099; 3 2.311,-3.099 | smd 3.6 x 2.2: 4 0,3.099
MSOP8 = smd 0.45 x 1: 1 -1.175,-1.875; 2 -0.525,-1.875; 3 0.125,-1.875; 4 0.775,-1.875; 5 0.775,2.225; 6 0.125,2.225; 7 -0.525,2.225; 8 -1.175,2.225
SOT23-8_2 = smd 0.406 x 0.813: 1 -1,-1.04; 2 -0.35,-1.04; 3 0.3,-1.04; 4 0.95,-1.04; 5 0.95,1.26; 6 0.3,1.26; 7 -0.35,1.26; 8 -1,1.26
QSOP16 = smd 0.4 x 1: 1 -2.223,-2.75; 2 -1.588,-2.75; 3 -0.953,-2.75; 4 -0.318,-2.75; 5 0.318,-2.75; 6 0.953,-2.75; 7 1.588,-2.75; 8 2.223,-2.75; 9 2.223,2.75; 10 1.588,2.75; 11 0.953,2.75; 12 0.318,2.75; 13 -0.318,2.75; 14 -0.953,2.75; 15 -1.588,2.75; 16 -2.223,2.75
TQFN12 = smd 1 x 0.3: P$1 0.05,-1.1; P$2 0.05,-2; P$3 0.05,-2.9; P$7 3.95,-2.9; P$8 3.95,-2; P$9 3.95,-1.1 | smd 0.3 x 1: P$4 1.1,-3.95; P$5 2,-3.95; P$6 2.9,-3.95; P$10 2.9,-0.05; P$11 2,-0.05; P$12 1.1,-0.05 | smd 2 x 2: P$13 2,-2
MSOP10 = smd 0.25 x 1: 1 -1,-2.113; 2 -0.5,-2.113; 3 0,-2.113; 4 0.5,-2.113; 5 1,-2.113; 6 1,2.113; 7 0.5,2.113; 8 0,2.113; 9 -0.5,2.113; 10 -1,2.113
FX2-100S-1.27 = drill 0.8: A1 0,0; A2 -1.27,-1.905; A3 -2.54,0; A4 -3.81,-1.905; A5 -5.08,0; A6 -6.35,-1.905; A7 -7.62,0; A8 -8.89,-1.905; A9 -10.16,0; A10 -11.43,-1.905; A11 -12.7,0; A12 -13.97,-1.905; A13 -15.24,0; A14 -16.51,-1.905; A15 -17.78,0; A16 -19.05,-1.905; A17 -20.32,0; A18 -21.59,-1.905; A19 -22.86,0; A20 -24.13,-1.905; A21 -25.4,0; A22 -26.67,-1.905; A23 -27.94,0; A24 -29.21,-1.905; A25 -30.48,0; A26 -31.75,-1.905; A27 -33.02,0; A28 -34.29,-1.905; A29 -35.56,0; A30 -36.83,-1.905; A31 -38.1,0; A32 -39.37,-1.905; A33 -40.64,0; A34 -41.91,-1.905; A35 -43.18,0; A36 -44.45,-1.905; A37 -45.72,0; A38 -46.99,-1.905; A39 -48.26,0; A40 -49.53,-1.905; A41 -50.8,0; A42 -52.07,-1.905; A43 -53.34,0; A44 -54.61,-1.905; A45 -55.88,0; A46 -57.15,-1.905; A47 -58.42,0; A48 -59.69,-1.905; A49 -60.96,0; A50 -62.23,-1.905; B1 0,3.8; B2 -1.27,1.895; B3 -2.54,3.8; B4 -3.81,1.895; B5 -5.08,3.8; B6 -6.35,1.895; B7 -7.62,3.8; B8 -8.89,1.895; B9 -10.16,3.8; B10 -11.43,1.895; B11 -12.7,3.8; B12 -13.97,1.895; B13 -15.24,3.8; B14 -16.51,1.895; B15 -17.78,3.8; B16 -19.05,1.895; B17 -20.32,3.8; B18 -21.59,1.895; B19 -22.86,3.8; B20 -24.13,1.895; B21 -25.4,3.8; B22 -26.67,1.895; B23 -27.94,3.8; B24 -29.21,1.895; B25 -30.48,3.8; B26 -31.75,1.895; B27 -33.02,3.8; B28 -34.29,1.895; B29 -35.56,3.8; B30 -36.83,1.895; B31 -38.1,3.8; B32 -39.37,1.895; B33 -40.64,3.8; B34 -41.91,1.895; B35 -43.18,3.8; B36 -44.45,1.895; B37 -45.72,3.8; B38 -46.99,1.895; B39 -48.26,3.8; B40 -49.53,1.895; B41 -50.8,3.8; B42 -52.07,1.895; B43 -53.34,3.8; B44 -54.61,1.895; B45 -55.88,3.8; B46 -57.15,1.895; B47 -58.42,3.8; B48 -59.69,1.895; B49 -60.96,3.8; B50 -62.23,1.895 | hole 2.3: -65.54,1.905; 3.31,1.905
1X03 = drill 1.016 pad 1.88: 1 -2.54,0; 2 0,0; 3 2.54,0
1X02 = drill 1.016 pad 1.88: 1 -1.27,0; 2 1.27,0
1X04 = drill 1.016 pad 1.88 square: 1 0,0 | drill 1.016 pad 1.88: 2 2.54,0; 3 5.08,0; 4 7.62,0
ST-5EW = smd 1.4 x 2: 1 -2.5,-2.6; 2 0,2.6; 3 2.5,-2.6
R0603 = smd 1 x 1.1: 1 -0.85,0; 2 0.85,0
TP = smd 3.81 x 2.032: TP 0,0

### Placement (x,y rotation side)
C1  10.77,28.45 180 top
C2  4.67,11.68 180 top
C3  10.77,42.67 180 top
C4  51.41,52.32 270 top
C5  58.52,33.02 90 top
C6  89.51,35.05 270 top
C7  93.68,41.76 270 top
C8  96.62,18.29 180 top
C9  91.54,35.05 270 top
C10  93.07,35.05 270 top
C11  76.4,29.97 270 top
C12  74.57,29.97 270 top
C13  73.05,29.97 270 top
C14  96.62,16.76 180 top
C15  96.11,21.34 270 top
C16  94.59,21.34 270 top
C17  95.2,24.49 180 top
C18  95.2,26.01 180 top
C19  55.47,24.89 90 top
C20  53.95,24.89 90 top
C21  57,19.81 180 top
C22  57,18.29 180 top
C23  58.01,27.43 180 top
C24  58.01,28.96 180 top
C25  116.94,31.5 270 top
C26  10.77,48.26 180 top
C27  10.77,34.04 180 top
C28  56.49,52.83 90 top
C29  111.86,31.5 270 top
C30  39.32,32 90 top
C31  44.4,32 90 top
C32  37.69,23.37 270 top
C33  39.22,17.27 270 top
C34  38.2,45.21 270 top
C35  4.67,17.27 180 top
C36  75.49,47.04 0 top
C37  75.49,48.56 0 top
C38  85.34,45.72 0 top
C39  63.09,48.77 0 top
C40  53.44,33.02 270 top
C41  98.76,41.76 90 top
C42  117.96,15.24 180 top
C43  37.69,70.61 90 top
C44  46.84,70.61 90 top
C45  54.46,70.61 90 top
C46  63.6,70.61 90 top
C47  32.11,21.34 270 top
C48  30.07,21.34 90 top
C49  31.6,45.21 270 top
C50  75.79,70.61 90 top
C51  84.94,70.61 90 top
C52  62.89,45.72 0 top
C53  63.09,47.24 180 top
C54  74.07,39.12 180 top
C55  67.56,34.95 180 top
C56  71.81,44.7 270 top
C57  71.73,50.9 0 top
IC1  81.89,23.11 270 top
IC2  26.01,46.23 270 top
IC3  26.01,30.99 270 top
IC4  26.01,17.27 270 top
IC5  10.77,45.72 270 top
IC6  10.77,31.5 270 top
IC7  4.67,14.73 270 top
IC8  53.95,52.83 180 top
IC9  59.03,70.61 0 top
IC10  55.98,33.02 0 top
IC11  42.27,70.61 0 top
IC12  34.65,21.34 180 top
IC13  96.22,41.76 180 top
IC14  34.65,44.2 180 top
IC15  80.37,70.61 0 top
IC16  114.4,31.5 0 top
IC17  41.86,32 180 top
IC18  18.9,48.77 180 top
IC19  18.9,34.54 180 top
IC20  18.9,19.81 180 top
IC21  68.17,43.18 0 top
IC22  101.7,23.37 270 top
IC23  62.08,43.18 90 top
J1  48.36,7.62 180 top
JP1  80.37,44.65 270 top
JP2  24.49,58.93 0 top
JP3  68.58,27.94 90 top
JP4  102.21,46.74 270 top
JP5  26.01,66.55 180 top
JP6  24.49,55.88 180 top
JP7  46.84,44.2 0 top
JP8  26.01,64.01 180 top
JP9  74.27,43.38 270 top
JP10  77.32,43.38 270 top
JP11  73.66,37.08 0 top
JP12  73.25,34.04 0 top
JP13  93.17,28.24 180 top
JP14  93.17,30.99 180 top
JP15  44.3,23.88 0 top
JP16  44.3,19.3 0 top
JP17  6.6,66.75 270 top
JP18  65.84,27.94 90 top
JP19  98.65,32 270 top
JP20  26.06,69.09 180 top
R1  108.81,42.67 90 top
R2  108.81,50.29 90 top
R3  99.16,12.7 180 top
R4  18.9,42.16 270 top
R5  18.9,27.94 270 top
R6  14.83,10.16 270 top
R7  60.05,15.75 270 top
R8  117.96,13.21 0 top
R9  38.71,7.62 270 top
R14  79.35,15.24 180 top
R15  79.35,16.76 0 top
R16  83.41,15.24 0 top
R17  83.41,16.76 180 top
R18  83.41,23.88 0 top
R19  83.41,22.35 180 top
R20  87.48,15.24 0 top
R21  87.48,16.76 180 top
R22  87.48,23.88 0 top
R23  87.48,22.35 180 top
R24  91.54,15.24 0 top
R25  91.54,16.76 180 top
R26  87.48,23.88 180 bottom
R27  87.48,22.35 0 bottom
R28  87.48,15.24 180 bottom
R29  87.48,16.76 0 bottom
R30  83.41,23.88 180 bottom
R31  83.41,22.35 0 bottom
R32  71.22,15.24 180 top
R33  71.22,16.76 0 top
R34  79.35,23.88 180 top
R35  79.35,22.35 0 top
R36  75.29,15.24 180 top
R37  75.29,16.76 0 top
R38  75.29,23.88 180 top
R39  75.29,22.35 0 top
R40  91.54,23.88 180 bottom
R41  91.54,22.35 0 bottom
R42  91.54,15.24 180 bottom
R43  91.54,16.76 0 bottom
TP1  32.11,68.58 0 top
TP2  15.85,67.56 0 top
TP3  32.11,64.01 0 top
TP4  15.85,64.01 0 top
TP5  50.39,68.58 0 top
TP6  67.16,68.58 0 top
TP7  98.55,37.8 180 top
TP8  53.59,36.53 0 top
TP9  102.92,29.36 0 top
TP10  102.92,34.54 0 top
TP11  34.65,27.94 0 top
TP12  50.9,14.73 0 top
TP13  31.6,16.15 0 top
TP14  43.79,14.73 0 top
TP15  58.22,48.97 0 top
TP16  108.31,32.51 0 top
TP17  46.84,29.97 270 top
TP18  18.9,59.94 0 top
TP19  32.11,58.42 0 top
TP20  83.41,51.31 90 top
TP21  86.16,43.28 180 top
TP22  96.11,46.33 0 top
TP23  47.85,36.58 0 top
TP24  26.01,39.62 0 top
TP25  27.53,27.94 0 top
TP26  26.52,13.72 0 top
TP27  115.42,42.67 0 top
TP28  102.82,54.05 0 top
TP29  32.11,54.86 0 top
TP30  30.58,49.78 0 top
TP31  56.29,57.71 0 top
TP32  51.31,20.73 90 top
TP33  106.99,18.49 0 top
TP34  31.09,39.62 0 top
TP35  23.98,23.88 0 top
TP36  21.44,15.75 0 top
TP37  43.79,39.62 0 top
TP38  62.69,33.32 0 top
TP39  12.29,57.91 0 top
TP41  9.96,51.92 0 top
TP42  8.33,37.49 0 top
TP43  10.47,15.95 0 top
TP44  32.11,73.15 0 top
TP45  87.68,66.04 0 top
U$5  61.06,25.4 270 top

### Tracks (layer width: path | path; a pad name or v marks a point on that pad's centre or on a via)
!CS_ADC1
  Top 0.254: IC22.P$9 100.6,15.12 102.92,12.8 102.92,9.58 J1.A44
!CS_ADC2
  Top 0.254: U$5.P$9 59.96,20.61 66.14,14.43 J1.A15
!CS_DAC  (via drill 0.6)
  Top 0.254: IC23.9 58.53,42.68 v57.71,41.86
  Bottom 0.254: J1.A17 68.68,12.19 68.68,14.63 62.59,20.73 61.77,21.54 61.77,21.95 61.77,34.14 61.37,34.54 57.3,38.61 57.3,41.45 v57.71,41.86
ADC1_IN+  (via drill 0.6)
  Top 0.254: IC22.P$12 102.74,22.27 v103.63,23.16
  Bottom 0.254: JP13.2 93.17,27.53 95.3,25.4 101.4,25.4 v103.63,23.16
ADC1_IN-
  Top 0.254: JP14.2 93.37,30.99 94.69,29.67 96.32,29.67 98.15,27.84 100.6,25.38 IC22.P$1
ADC2_IN+
  Top 0.254: JP3.2 67.67,27.94 67.16,27.43 67.16,24.38 66.65,23.88 66.55,23.77 65.33,23.77 64.8,24.3 U$5.P$12
ADC2_IN-
  Top 0.254: JP18.2 61.37,27.94 60.05,26.62 59.96,26.54 U$5.P$1
AGND  (via drill 0.6)
  Top 0.254: IC1.48 IC1.49 | 96.11,43.16 IC13.2 | IC1.16 79.41,37.13 | IC1.32 78.76,29.44 79.35,28.85
  Top 0.406: 25.6,58.93 JP2.2 26.26,58.42 TP19.TP | 23.37,56.03 JP6.2 | C10.2 C9.2 91.44,34.1 C6.2 89.43,34.02 IC1.58 86.98,34.02 86.67,34.34 86.67,36.78 86.91,37.02 IC1.1 IC1.64 89.15,37.02 | IC13.2 96.22,42.27 96.47,42.01 | 96.47,42.01 96.72,41.76 97.91,41.76 C41.2 98.86,42.71 | C7.2 94.55,41.11 95.2,41.76 96.22,41.76 | 96.22,41.76 96.47,42.01 | 89.15,37.02 93.62,37.02 95.71,39.12 96.22,39.62 96.22,41.76 | v88.49,38.61 88.49,37.67 89.15,37.02 | TP22.TP 96.11,43.16 | 79.55,36.98 78.74,36.98 78.74,37.19 v77.52,38.41 77.52,38.61 | IC1.32 79.41,29.52 80.37,30.48 81.18,30.48 82.4,31.7 84.84,31.7 87.07,29.46 87.5,29.46 IC1.49
  Top 0.508: 25.6,58.93 23.37,56.69 23.37,56.03 | R2.3 111.41,54.6 v110.74,55.27 | 79.41,37.13 79.55,36.98
  Route2 0.406: v88.49,38.61 87.99,39.12 87.99,47.24 80.87,54.36 76.3,58.93 JP2.2 | JP2.2 25.6,58.93 25.05,58.37 25.2,58.37 JP2.2
  Route2 0.508: v110.74,55.27 81.79,55.27 80.87,54.36
  other vias: 88.7,28.04
  pour Top: 76.3,39.62 74.78,39.62 74.78,26.42 90.53,26.42 90.53,39.62
  pour Route2: 90.53,39.62 74.78,39.62 74.78,26.42 90.53,26.42
AVDD
  Top 0.406: IC1.62 89.49,36.02 C6.1 91.44,36 C9.1 C10.1 96.66,35.9 TP7.TP 98.76,38 C41.1 | C41.1 97.62,40.91 IC13.5 | C41.1 110.78,40.91 111.86,39.83 111.76,39.83 R1.1
BASELINE
  Top 0.254: IC1.56 93.98,33.02 95.5,34.54 JP19.1 TP10.TP
CAP_PRECHAR
  Top 0.254: C38.2 86.19,43.32 TP21.TP 85.95,43.08 84.43,43.08 80.41,39.06 IC1.14
CAP_PRECHAR_1
  Top 0.254: JP1.1 80.37,47.75 78.54,49.58 71.42,49.58 71.22,49.58 | IC21.12 68.48,45.94 68.48,47.65 70.41,49.58 71.22,49.58 | C57.1 70.88,49.92 71.22,49.58
CLK  (via drill 0.6)
  Top 0.254: IC1.20 79.72,35.52 v80.16,35.97
  Bottom 0.254: R30.1 R31.2 82.56,24.02 81.89,24.69 81.79,24.79 81.79,32.31 81.28,32.82 81.28,34.85 v80.16,35.97
CLK_ADC1
  Top 0.254: IC22.P$10 101.65,15.29 104.34,12.6 104.34,7.72 J1.A45
CLK_ADC2
  Top 0.254: U$5.P$10 61.01,20.88 67.16,14.73 67.41,14.48 J1.A16
CLK_DAC  (via drill 0.6)
  Top 0.254: IC23.6 59.96,45.19 58.83,46.33 v57.91,46.33
  Bottom 0.254: J1.A19 71.22,14.33 70.97,14.58 63.2,22.35 62.99,22.55 62.99,22.76 62.99,34.34 63.6,34.95 63.6,35.15 63.6,38.2 61.98,39.83 61.98,42.27 v57.91,46.33
CLK_PRECH1  (via drill 0.6)
  Top 0.254: IC1.9 82.91,37.08 83.11,36.88 84.63,36.88 v85.45,36.07
  Bottom 0.254: v85.45,36.07 86.77,34.75 86.77,28.35 86.97,28.14 90.69,24.42 R40.1 R41.2
CLK_PRECH1_T
  Bottom 0.254: 94.59,21.84 94.59,21.34 | 94.59,21.34 94.59,19.81 98.15,16.26 100.43,13.97 J1.A42 | R40.2 94.08,23.88 94.59,23.37 94.59,21.34
CLK_PRECH2  (via drill 0.6)
  Top 0.254: IC1.10 82.41,36.87 v83.41,35.87
  Bottom 0.254: v83.41,35.87 86.16,33.12 86.16,28.14 89.61,24.69 89.81,24.49 89.81,18.8 90.69,17.92 R43.2 R42.1
CLK_PRECH2_T
  Bottom 0.254: R42.2 95.61,15.24 97.64,13.21 97.89,12.95 J1.A40
CLK_REF  (via drill 0.6)
  Top 0.254: IC20.4 17.45,20.85 v15.95,22.35 | IC18.4 17.15,49.81 v15.75,51.21 | IC19.4 17.35,35.58 v16.16,36.78
  Bottom 0.254: J1.A8 57.25,11.53 57.2,11.58 51.71,17.07 26.72,17.07 26.32,17.48 21.44,22.35 v15.95,22.35 14.94,23.37 14.94,38 | 14.94,38 v16.16,36.78 14.94,38 | 14.94,38 14.94,50.39 v15.75,51.21
CLK_T
  Bottom 0.254: R30.2 84.94,23.88 85.14,23.67 85.14,14.33 87.78,11.68 87.78,9.58 J1.A32
CS_B0
  Top 0.254: R14.1 R15.2 80.2,17.11 81.08,17.98 81.08,24.89 83.31,27.13 83.41,27.23 IC1.41
CS_B0_T
  Top 0.254: J1.A26 80.11,12.65 78.44,14.33 78.44,15.18 R14.2
CS_B1
  Top 0.254: R16.1 R17.2 81.69,17.64 81.69,24.69 83.91,26.91 IC1.42
CS_B1_T
  Top 0.254: J1.A28 82.65,11.63 84.33,13.31 84.33,15.18 R16.2
CS_B2
  Top 0.254: IC1.43 84.41,25.79 83.92,25.3 82.7,24.08 82.56,23.94 R18.1 R19.2
CS_B2_T
  Top 0.254: J1.A30 85.14,9.58 85.14,21.84 85.14,23.67 84.94,23.88 R18.2
CS_B3
  Top 0.254: R20.1 R21.2 86.46,16.93 86.46,18.29 85.75,19 85.75,24.28 85.55,24.49 84.91,25.12 IC1.44
CS_B3_T
  Top 0.254: J1.A34 90.27,11.94 88.49,13.72 88.49,15.07 R20.2
CS_B4
  Top 0.254: IC1.45 85.41,25.44 86.46,24.38 86.46,24.04 R22.1 R23.2
CS_B4_T
  Top 0.254: J1.A36 92.81,10.92 92.05,11.68 89.51,14.22 89.51,18.29 89.51,20.32 89.51,21.84 89.51,23.37 89,23.88 R22.2
CS_B5
  Top 0.254: R24.1 R25.2 90.63,16.76 90.02,17.37 90.02,23.88 89.71,24.18 87.99,25.91 85.91,27.98 IC1.46
CS_B5_T
  Top 0.406: J1.A38 95.35,10.92 92.56,13.72 92.56,15.07 R24.2
CS_REF_1  (via drill 0.6)
  Top 0.254: IC18.6 18.6,48.56 18.39,48.77 v16.56,48.77
  Bottom 0.254: v16.56,48.77 21.64,48.77 30.18,40.23 30.58,39.83 46.63,39.83 49.48,36.98 49.48,27.23 50.7,26.01 62.28,14.43 62.28,9.58 J1.A12
CS_REF_2  (via drill 0.6)
  Top 0.254: IC19.6 18.6,34.34 18.39,34.54 v16.56,34.54
  Bottom 0.254: v16.56,34.54 21.44,34.54 29.77,26.21 48.46,26.21 59.64,15.04 59.64,9.68 J1.A10
CS_REF_3  (via drill 0.6)
  Top 0.254: IC20.6 18.6,19.3 18.19,19.71 15.75,19.71 v14.94,20.52
  Bottom 0.254: v14.94,20.52 22.45,20.52 26.52,16.46 51.51,16.46 55.98,11.99 J1.A7
DGND  (via drill 0.6)
  Top 0.254: IC1.28 78.73,31.5 78.13,31.5 77.52,30.89 77.52,30.07 76.47,29.02 C11.2 74.67,29.02 C12.2 C13.2 72.2,29.97 v71.73,29.97
  Top 0.406: C40.2 53.61,32.17 54.46,33.02 55.47,33.02 55.98,32.51 | 55.98,32.51 IC10.2 | C5.2 58.16,33.67 57.51,33.02 56.49,33.02 55.98,32.51 | TP29.TP 26.77,54.86 JP6.1 | v43.08,37.59 46.84,37.59 TP23.TP 48.67,35.76
  Top 0.508: C40.2 51.65,32.17 48.67,35.15 48.67,35.76
  Route2 0.406: v71.73,29.97 68.68,33.02 51.92,33.02 49.78,33.02 46.02,36.78 43.89,36.78 v43.08,37.59 42.16,37.59 40.74,39.01 40.74,45.52 30.38,55.88 JP6.1
DVDD  (via drill 0.6)
  Top 0.254: C13.1 C12.1 76.3,30.82 C11.1 76.98,31.5 77.32,31.5 77.85,32.02 IC1.27 79.35,32.02 80.16,32.84 80.16,33.83 v80.26,33.93
  Top 0.406: TP8.TP 55.03,35.09 IC10.5 54.58,33.87 C40.1 52.77,34.54 v51.41,34.54
  Route3 0.406: v51.41,34.54 51.92,34.04 68.68,34.04 71.22,31.5 71.42,31.29 77.72,31.29 77.72,31.39 78.13,31.8 v80.26,33.93
GND  (via drill 0.6)
  Top 0.254: IC18.3 18.6,49.37 19.71,48.26 | 19.71,48.26 19.81,48.16 | IC18.8 19.9,48.07 19.71,48.26 | C52.2 63.74,45.75 C53.2 C39.1 62.24,49.92 v61.37,50.8 | IC19.3 18.6,34.95 18.7,34.85 19.2,34.34 19.61,34.34 19.9,34.05 19.9,33.65 IC19.8 20.67,33.28 22.96,30.99 IC3.2 | IC20.3 18.6,20.11 18.7,20.02 19.2,19.51 19.61,19.51 19.81,19.3 19.9,19.22 19.9,18.81 IC20.8 19.9,17.29 TP36.TP 22.45,15.75 23.98,17.27 IC4.2 | C16.2 C15.2 | R8.1 117.11,12.87 v115.93,11.68 | 87.99,19.3 88.33,19.65 R27.1 | 87.99,19.3 v87.48,19.81 | R29.1 88.33,18.96 87.99,19.3 | 84.26,19.3 R17.1 | R15.1 78.5,17.84 78.5,18.66 78.99,19.15 | R31.1 84.26,19.3 | 84.26,19.3 83.41,19.3 v82.91,19.81 | 78.99,19.15 v79.66,19.81 | R35.1 78.5,19.65 78.99,19.15 | R37.1 74.44,18.96 74.78,19.3 | 74.78,19.3 v75.29,19.81 | R39.1 74.44,19.65 74.78,19.3 | v30.07,43.18 30.07,40.64 TP34.TP | C32.2 37.45,22.52 36.88,21.95 33.57,21.95 C47.2 31.97,20.62 31.5,20.62 30.07,22.05 C48.2 30.04,22.15 28.96,22.15 28.14,22.96 v28.14,23.37 27.64,23.88 TP35.TP | C21.2 C22.2 | C19.2 C20.2 | C23.2 57.51,27.43 C23.2 | C23.2 57,27.43 | 57,27.43 57,28.79 C24.2 | U$5.P$3 58.16,26.43 C23.2 | v54.97,27.94 54.97,26.25 C19.2 | 57,27.43 57,27.27 C19.2 | U$5.P$6 57.11,20.78 C21.2 | C14.2 C8.2 | C15.2 96.11,20.32 97.6,20.32 IC22.P$6 | C18.2 C17.2 95.52,23.32 96.16,23.32 IC22.P$3 | IC23.3 66.75,43.18 v67.26,42.67 67.46,42.88 68.28,42.88 69.25,43.85 C56.2 | IC21.10 69.76,47.41 v69.9,47.55 | IC21.8 71.41,39.42 v71.53,39.42 72.91,39.42 C54.2 | IC21.13 67.86,49.49 v67.67,49.68 | R33.1 70.37,19.16 v71.12,19.91 | v103.33,18.49 107.59,18.49 TP33.TP | C21.2 54.46,19.81 v53.85,19.2 | v37.29,13.61 37.29,15.44 38.3,16.46 39.18,16.46 C33.2
  Top 0.254: R43.1 93.27,16.76 93.88,16.76 94.79,17.68 94.79,18.09 95,18.29 | 95,18.29 94.79,18.29 94.69,18.39 94.08,18.39 v93.68,18.39 | 95,18.29 C8.2 | C8.2 95.77,20.14 C15.2 | R6.3 6.67,7.66 4.17,10.16 4.17,11.54 C2.2
  Top 0.305: IC5.2 10.46,45.72 10.67,45.92 10.67,47.51 C26.2
  Top 0.406: IC5.2 8.23,45.72 8.23,43.69 v8.74,43.18 9.61,43.18 C3.2 10.26,42.53 10.26,41.66 12.25,39.66 R4.3 | C27.2 10.77,33.19 10.77,32 10.26,31.5 IC6.2 8.64,31.5 8.23,31.09 8.23,29.67 8.74,29.16 v8.74,28.96 9.25,28.45 C1.2 10.12,27.07 11.79,25.4 16.26,25.4 R5.3 18.6,23.14 IC20.3 | IC18.8 21.03,47.51 | 21.03,47.51 22.09,47.51 23.27,46.33 23.37,46.23 IC2.2 | R4.3 16.3,41.39 20.42,45.52 20.42,46.9 21.03,47.51 | R4.3 16.3,39.18 18.39,37.08 18.6,36.88 IC19.3 | v30.07,43.18 31.26,44.36 C49.2 C34.2 | v35.66,72.34 36.82,72.34 C43.2 | C42.2 R8.1 | 54.25,52.83 55.47,52.83 56.32,53.68 C28.2 56.49,55.88 56.49,56.59 55.78,57.3 | 54.25,52.83 54.05,53.03 53.95,53.14 IC8.2 | C25.2 116.94,29.46 116.43,28.96 114.91,28.96 114.4,29.46 IC16.2 114.4,31.5 112.88,31.5 112.03,30.65 C29.2 v111.86,28.96 | v72.54,53.85 72.54,50.94 C57.2 | C55.2 65.84,34.95 64.21,34.95 | C4.2 51.41,50.8 51.92,50.29 52.02,50.19 53.44,50.19 54.25,51 54.25,52.83 | v35.15,8.94 38.24,8.94 R9.1 | 64.21,34.95 v62.18,36.98 | 64.21,34.95 64.21,34.85 TP38.TP | TP32.TP 52.32,20.73 v53.85,19.2 | 55.78,57.3 55.37,57.71 TP31.TP 55.98,57.4 | v52.43,57.4 55.68,57.4 55.78,57.3
  Top 0.508: C35.2 4.67,16.42 4.67,15.24 4.17,14.73 IC7.2 2.13,14.73 1.63,14.22 1.63,12.7 v2.13,12.19 3.52,12.19 C2.2 | 18.39,59.94 TP18.TP 19.41,59.94 | 19.41,59.94 22.2,59.94 JP2.1 | C50.2 76.3,71.46 | 76.3,71.46 78.74,71.46 | 78.74,71.46 C51.2 | IC15.2 80.37,69.84 78.74,71.46 | v92.36,25.7 94.05,25.7 C18.2 | v75.29,73.66 75.29,72.48 76.3,71.46 | C31.2 43.65,32.11 42.37,32.11 41.86,32.61 IC17.2 41.86,34.44 | C30.2 39.32,33.93 40.13,34.75 41.55,34.75 41.66,34.65 | 41.86,34.44 41.66,34.65 | 41.86,34.44 41.86,34.65 | C43.2 40.91,71.46 41.5,70.87 | 41.5,70.87 42.27,70.1 IC11.2 | 41.5,70.87 42.1,71.46 C44.2 54.12,71.46 54.46,71.12 C45.2 54.62,71.63 57.51,71.63 58.27,70.87 | IC9.2 59.03,70.1 58.27,70.87 | C46.2 58.86,71.46 58.27,70.87 | v43.18,35.36 42.37,35.36 41.66,34.65 | JP17.3 17.68,61.67 19.41,59.94
  Bottom 0.254: R29.1 88.33,17.95 88.33,18.96 v87.48,19.81 88.33,20.66 R27.1 | R31.1 84.26,21.17 v82.91,19.81 | JP14.1 95.71,33.33 v95.91,33.53 | R41.1 92.56,22.35 93.78,21.13 93.78,19.71 93.78,18.49 v93.68,18.39 92.39,17.11 R43.1
  other vias: 114.91,58.42
  pour Route2: 0.2,77.01 128.32,77.01 128.73,0 0.1,0
  pour Top (rank 2): 1.63,76.2 1.12,76.2 1.12,0.51 127.61,0.51 127.61,4.06 127.61,76.2
HOLD
  Top 0.254: R39.2 R38.1 76.14,24.83 77.12,25.81 79.55,25.81 81.38,27.64 81.41,27.66 81.41,27.87 IC1.37
HOLD_T
  Top 0.254: R38.2 73.97,23.88 73.56,23.47 73.56,13.72 76.2,11.07 76.2,7.72 J1.A23
MUX_DAC_EN  (via drill 0.6)
  Top 0.254: IC21.15 66.59,50.05 v65.84,50.8
  Bottom 0.254: v65.84,50.8 65.13,50.09 65.02,49.99 65.02,34.75 64.21,33.93 64.21,33.73 64.21,23.47 73.86,13.72 73.86,10.97 73.86,7.72 J1.A21
MUX_DAC_SEL  (via drill 0.6)
  Top 0.254: IC21.1 64.61,40.43 v64.11,39.93
  Bottom 0.254: J1.A20 72.54,9.58 72.54,10.97 72.54,14.02 68.89,17.68 63.6,23.16 63.6,33.93 63.6,34.14 64.21,34.75 64.21,39.83 v64.11,39.93
MUX_REF_1  (via drill 0.6)
  Top 0.254: IC2.6 26.96,47.99 v27.33,48.36
  Bottom 0.254: v27.33,48.36 28.55,48.36 | 28.55,48.36 29.16,48.36 | 28.55,48.36 32,48.36 39.93,40.44 47.04,40.44 50.09,37.39 50.09,27.64 51.51,26.21 57.61,20.12 62.89,14.83 63.6,14.12 J1.A13
MUX_REF_2  (via drill 0.6)
  Top 0.254: IC3.6 26.96,31.94 v28.55,33.53
  Bottom 0.254: v28.55,33.53 38.91,33.53 45.62,26.82 48.87,26.82 61.06,14.63 J1.A11
MUX_REF_3  (via drill 0.6)
  Top 0.254: IC4.6 26.96,18.53 v27.74,19.3
  Bottom 0.254: v27.74,19.3 27.94,19.3 29.57,17.68 51.92,17.68 58.32,11.28 58.52,11.07 J1.A9
N$1
  Top 0.254: JP9.2 74.27,42.67 75.69,44.09 75.69,46.39 C36.2 | 76.64,46.94 C36.2 | C36.2 76.37,47.04 | C37.1 74.81,48.56 C36.2
N$2
  Top 0.406: R9.2 38.71,4.57 39.73,3.56 41.05,2.23 46.84,2.23 48.1,3.5 48.1,3.56 J1.B1
N$3
  Top 0.254: JP10.1 77.32,47.79 76.54,48.56 C37.2
N$4
  Bottom 0.406: J1.A46 J1.A48
N$5
  Top 0.254: IC4.1 23.84,17.92 20.93,20.83 19.92,20.83 IC20.1
N$6
  Top 0.254: JP1.2 82.18,44.65 83.05,45.52 84.43,45.52 84.49,45.58 C38.1
N$9
  Bottom 0.254: JP13.1 95.71,28.75 98.04,31.09 98.04,31.39 JP19.2
N$10
  Top 0.406: J1.B50 110.59,7.06 111.76,8.23 115.93,8.23 118.81,11.11 R8.2 C42.1
N$17
  Top 0.254: IC18.1 22.13,49.81 IC2.1
N$19
  Top 0.254: IC19.1 20.2,35.58 24.18,31.6 25.02,31.6 IC3.1
OP_MODE  (via drill 0.6)
  Top 0.254: IC1.11 81.91,35.74 v83.41,34.24
  Bottom 0.254: v83.41,34.24 85.55,32.11 85.55,27.94 85.75,27.74 86.51,26.98 86.63,26.86 R26.1 R27.2
OP_MODE_T
  Bottom 0.254: J1.A35 91.44,7.72 91.44,12.29 89.2,14.53 89.2,22.05 89.2,23.67 89,23.88 R26.2
OUT_S
  Top 0.254: R32.1 R33.2 72.54,17.23 72.54,18.93 72.54,23.88 75.08,26.42 79.35,26.42 79.76,26.82 80.41,27.48 80.41,27.68 IC1.35
OUT_S_T
  Top 0.254: J1.A22 75.03,11.02 72.95,13.11 70.92,13.11 70.37,13.65 R32.2
POT_R1
  Top 0.254: R1.2 108.91,42.67 109.27,43.03 | 109.27,43.03 R1.3 | JP4.3 104.69,44.2 R1.2 | 106.27,42.61 R1.2 | TP27.TP 109.63,42.67 109.27,43.03
POT_R2
  Top 0.254: R2.1 110.3,47.79 107.8,50.29 R2.2 104.34,50.29 | 104.34,50.29 103.23,50.29 JP4.1 | TP28.TP 102.82,51.82 104.34,50.29
POT_R4
  Top 0.254: IC2.3 25,45.52 23.67,45.52 21.5,43.34 R4.2 23.77,42.16 24.08,41.86 26.01,39.93 TP24.TP
POT_R5
  Top 0.254: R5.2 21.5,28.51 23.37,30.38 | 23.37,30.38 25.02,30.38 IC3.3 | TP25.TP 26.01,27.74 23.37,30.38
POT_R6
  Top 0.254: IC4.3 25.06,15.17 TP26.TP 22.96,10.16 R6.2
REF_ADC  (via drill 0.6)
  Top 0.254: C17.1 C18.1 97.23,26.01 v97.64,26.42 99.7,24.35 IC22.P$2 | U$5.P$2 59.06,27.23 C23.1 C24.1
  Top 0.508: C24.1 58.86,29.81 59.28,30.23 | 59.28,30.23 v60.05,30.99 | 59.28,30.23 59.13,30.07 49.28,30.07 46.94,30.07 TP17.TP 45.66,31.15 45.38,31.15 C31.1 43.26,31.15 IC17.5
  Route3 0.508: v97.64,26.42 96.11,26.42 93.07,23.37 63.6,23.37 62.59,24.38 62.59,28.45 v60.05,30.99
REFIN_DAC
  Top 0.254: IC23.10 61.18,42.18 61.26,42.27
  Top 0.406: IC8.5 55.47,51.53 56.04,51.53 C28.1 56.49,50.8 58.22,49.07 TP15.TP 59.96,47.22 60.66,46.53 60.66,45.11 61.26,44.5 61.26,42.27
RES_BIAS_EXT
  Top 0.254: IC1.6 84.41,38.59 86.06,40.23 88.49,40.23 89.51,41.25 89.51,45.72 92.15,48.36 100.58,48.36 JP4.2
RST
  Top 0.254: R36.1 R37.2 76.14,17.61 76.14,17.92 76.91,18.69 | 76.91,18.69 77.01,18.8 | IC1.38 81.91,27.55 81.91,27.35 81.89,27.33 80.57,26.01 79.76,25.2 78.13,25.2 77.12,24.18 77.12,18.9 76.91,18.69
RST_CSA  (via drill 0.6)
  Top 0.254: IC1.12 81.41,39.04 81.89,39.52 82.8,39.52 v82.91,39.62
  Bottom 0.254: R28.1 R29.2 86.63,18.12 85.75,19 85.75,26.62 85.45,26.92 84.94,27.43 84.94,30.48 81.89,33.53 81.89,38.61 v82.91,39.62
RST_CSA_T
  Bottom 0.254: R28.2 88.33,12.76 89,12.09 J1.A33
RST_T
  Top 0.254: J1.A24 77.57,10.92 74.58,13.92 74.58,15.1 R36.2
SDI_DAC  (via drill 0.6)
  Top 0.254: IC23.7 58.73,43.68 v57.91,44.5
  Bottom 0.254: J1.A18 69.9,9.58 69.9,11.18 69.9,14.63 66.24,18.29 62.38,22.15 62.38,22.45 62.38,34.34 62.38,34.54 58.83,38.1 58.83,43.48 57.91,44.4 v57.91,44.5
SDI_REF  (via drill 0.6)
  Top 0.254: IC18.5 14.98,47.51 13.72,48.77 13.72,49.58 v13.51,49.78 | IC19.5 15.59,33.28 v13.11,35.76 | IC20.5 15.08,18.55 v14.94,18.69
  Bottom 0.254: v14.94,18.69 16.16,18.69 | 16.16,18.69 18.8,16.05 19,15.85 51.31,15.85 54.76,12.39 54.76,9.58 J1.A6 | 16.16,18.69 14.73,18.69 13.51,19.91 13.51,25.6 14.12,26.21 14.33,26.42 14.33,33.73 | 14.33,33.73 14.33,48.97 v13.51,49.78 | v13.11,35.76 13.11,34.95 14.33,33.73
SDO_ADC1
  Top 0.254: IC22.P$8 99.7,14.8 100.99,13.51 | 100.99,13.51 101.5,13.01 101.7,12.8 J1.A43 | 100.18,12.7 100.99,13.51
  Top 0.406: R3.1 100.18,12.7
SDO_ADC2
  Top 0.254: U$5.P$8 59.06,20.49 60.91,18.64 | 60.91,18.64 64.92,14.63 64.92,9.58 J1.A14 | R7.1 60.05,17.78 60.91,18.64
SGN
  Top 0.254: R35.2 R34.1 80.2,24.83 80.77,25.4 82.4,27.03 82.4,27.43 82.4,28.86 IC1.39
SGN_T
  Top 0.254: R34.2 78.03,23.88 77.62,23.47 77.62,13.31 78.84,12.09 J1.A25
V0NDAC
  Top 0.254: 68.48,40.44 IC21.5 68.49,38.93 68.49,38.82 67.67,38 67.46,37.8 64.92,37.8 64.11,38.61 63.6,39.12 62.59,40.13 62.59,42.16 63.1,42.68 IC23.2
V0PDAC
  Top 0.254: IC23.1 66.23,42.18 66.65,41.76 66.65,40.49 IC21.2
V1NDAC
  Top 0.254: IC21.14 67.26,45.89 67.26,44.81 66.63,44.18 IC23.5 64.4,44.18 65.02,44.81 65.02,46.16 C53.1
V1PDAC
  Top 0.254: IC21.11 69.09,45.89 69.09,44.4 68.37,43.68 IC23.4 62.9,43.68 62.79,43.79 62.04,44.54 C52.1
V_REF_PRECHAR  (via drill 0.6)
  Top 0.254: IC1.7 83.91,40.12 v84.43,40.64
  Top 0.406: TP37.TP 44.2,39.62 46.63,42.06 46.63,43.99 JP7.2
  Bottom 0.254: JP7.2 46.84,47.55 47.65,48.36 55.07,48.36 59.54,52.83 79.15,52.83 82.4,49.58 84.63,47.35 84.63,40.84 v84.43,40.64
V_REF_PRECHAR_BUFF
  Top 0.254: IC14.1 35.82,45.97 35.86,45.92 | 35.86,45.92 35.32,45.92 IC14.2 | 35.86,45.92 38.06,45.92 C34.1 41.01,46.06 42.43,46.06 JP7.1
VDD  (via drill 0.6)
  Top 0.254: IC21.16 65.95,47.94 65.13,48.77 C39.2 63.8,48.91 v63.8,50.8 | 54.66,43.18 v54.46,42.98 | IC23.8 58.52,43.18
  Top 0.305: IC5.3 IC5.4 12.07,43.32 C3.1
  Top 0.406: C44.1 46.83,69.76 | IC6.3 IC6.4 11.42,29.9 C1.1 11.62,28.65 v13.11,28.65 | IC18.2 19.25,50.44 19.81,51 22.45,51 24.59,48.87 | 24.59,48.87 25.91,47.55 25.91,46.53 26.11,46.33 26.21,46.23 IC2.5 | v25.5,49.99 25.5,49.78 24.59,48.87 | IC19.2 19.25,36.22 19.61,36.58 20.42,36.58 24.28,32.72 | 24.28,32.72 25.71,32.72 25.91,32.51 25.91,31.5 26.32,31.09 26.42,30.99 IC3.5 | 24.28,32.72 24.28,34.34 v24.49,34.54 | IC20.2 19.25,21.58 19.61,21.95 22.86,21.95 24.99,19.81 | 24.99,19.81 25.91,18.9 25.91,17.68 26.11,17.48 26.32,17.27 IC4.5 | v25.91,20.93 25.91,20.73 24.99,19.81 | v46.84,67.06 46.63,67.06 | 12.07,43.32 12.66,43.32 13.11,42.88 v13.11,41.45 | 54.66,43.18 58.52,43.18
  Top 0.508: 45.38,68.31 45.99,68.92 46,68.92 C44.1 48.02,68.58 TP5.TP | 46.63,67.06 45.38,68.31 | IC7.3 IC7.4 6.6,13.15 v6.6,11.99 6.3,11.68 C2.1 | 45.38,68.31 IC11.3
  pour Route3: 0.2,77.01 128.32,77.01 128.73,0 0.1,0
VDD2  (via drill 0.6)
  Top 0.406: IC9.3 62.76,68.92 | 62.76,68.92 C46.1 | TP6.TP 64.52,68.58 | 64.52,68.58 63.09,68.58 62.76,68.92 | IC13.3 94.33,43.06 C7.1 93.61,42.47 92.76,42.47 92.56,42.27 92.56,41.66 | IC13.4 95.02,40.46 94.39,39.83 93.17,39.83 92.56,40.44 92.56,41.66 | IC10.3 57.58,32.37 C5.1 58.89,32.37 59.64,33.12 59.64,34.14 59.03,34.75 57.61,34.75 | 57.61,34.75 57.36,34.75 IC10.4 | v91.14,42.67 91.54,42.67 92.56,41.66 | v56.59,36.17 56.59,35.76 57.61,34.75 | v64.11,66.24 64.11,68.17 64.52,68.58
  Route3 0.406: v56.59,36.17 56.59,53.65 | 56.59,53.65 56.59,59.54 56.59,60.55 61.06,65.02 62.89,65.02 v64.11,66.24 64.21,66.14 | v91.14,42.67 81.59,52.22 58.62,52.22 58.01,52.22 56.59,53.65
VDD3  (via drill 0.6)
  Top 0.254: C16.1 C15.1 | 96.2,22.27 C15.1 | 96.52,22.59 C15.1 | C20.1 C19.1 55.73,24.3 U$5.P$4 | 53.61,24.38 C20.1 | 52.12,25.4 53.34,24.18 | 53.34,24.18 53.81,24.18 C20.1 | 53.34,24.18 52.12,25.4 | 52.12,25.4 52.12,27.94 v52.02,28.04
  Top 0.406: C16.1 94.32,22.19 | IC16.4 116,32.15 C25.1 117.45,32.65
  Top 0.508: IC15.3 84.25,69.07 | 84.25,69.07 C51.1 | IC22.P$4 97.43,22.59 96.52,22.59 C15.1 | 94.32,22.19 93.41,22.19 92.56,21.34 92.56,20.22 v92.66,20.12 | IC12.8 36.87,19.11 v37.19,18.8 | IC14.8 36.36,41.97 v37.19,41.15 | v36.07,31.7 36.47,31.29 37.69,31.29 39.26,31.29 C30.1 40.26,31.35 IC17.4 IC17.3 | IC8.4 IC8.3 51.69,54.13 51.16,53.59 | C4.1 51.41,53.34 51.16,53.59 | 51.16,53.59 v50.39,54.36 | 117.45,32.65 v117.45,34.04 | IC16.3 IC16.4 | 84.25,69.07 86.46,66.85 86.87,66.85 TP45.TP 88.29,65.33 v90.32,63.3
  Route3 0.508: 107.8,35.56 107.8,51.31 96.57,62.53 96.52,62.59 91.03,62.59 v90.32,63.3 | 107.8,35.56 107.8,31.5 100.18,23.88 96.42,23.88 v92.66,20.12 89.71,20.12 88.49,21.34 53.95,21.34 51.92,23.37 49.89,25.4 49.89,27.64 | v37.19,18.8 39.22,20.83 39.22,26.42 | 39.22,26.42 39.22,29.46 | 39.22,29.46 39.22,38.1 39.22,39.12 v37.19,41.15 | 39.22,26.42 40.74,27.94 49.89,37.08 49.89,38.61 | v36.07,31.7 36.98,31.7 39.22,29.46 | v117.45,34.04 109.32,34.04 107.8,35.56 | 49.89,38.61 49.89,27.64 | v50.39,54.36 50.39,50.8 51.71,49.48 51.71,41.25 49.89,39.42 49.89,38.61 | v52.02,28.04 50.29,28.04 49.89,27.64
VDD_REF_1
  Top 0.305: 14.58,46.38 14.29,46.67 IC5.5 12.07,47.81 C26.1 | 14.58,46.38 R4.1 | IC18.7 19.25,46.58 19,46.33 14.63,46.33 14.58,46.38
  Top 0.508: C26.1 11.62,50.26 TP41.TP
VDD_REF_2
  Top 0.254: R5.1 15.59,30.44 14.83,31.19 | 14.83,31.19 13.62,32.41 12.11,32.41 IC6.5 11.62,32.9 C27.1 | IC19.7 19.25,32.76 18.49,32 15.65,32 14.83,31.19
  Top 0.508: 12.11,32.41 12.11,33.72 TP42.TP
VDD_REF_3
  Top 0.508: C35.1 5.97,16.82 IC7.5 6.57,15.68 10.26,15.68 10.26,15.95 TP43.TP 10.46,14.43 R6.1 12.3,12.6 14.12,12.6 16.56,15.04 19.25,17.72 IC20.7
VDD_SUPPLY_1
  Top 0.508: JP5.1 30.07,66.55 TP1.TP 36.51,68.58 C43.1 IC11.1
VDD_SUPPLY_2
  Top 0.508: JP8.1 TP3.TP 53.21,64.01 IC9.1 C45.1
VDD_SUPPLY_3
  Top 0.508: IC15.1 75.81,69.76 C50.1 75.73,69.7 74.47,69.7 68.58,75.59 43.48,75.59 34.54,75.59 TP44.TP 28.04,69.09 JP20.1 26.52,69.09
VDD_SUPPLY_IN_1
  Top 0.508: 21.64,67.56 TP2.TP 7.42,67.56 JP17.1 | 21.64,67.56 23.72,67.56 JP5.2 | JP20.2 23.16,69.09 21.64,67.56
  Route3 0.254: 23.98,66.55 JP5.2
VDD_SUPPLY_IN_2
  Top 0.508: JP8.2 TP4.TP 15.44,64.21 JP17.2
VI+_FIL
  Top 0.254: JP11.2 74.93,36.52 76.91,34.54 76.93,34.52 IC1.22
VI+_FIL_DAC  (via drill 0.6)
  Top 0.254: JP11.1 72.85,37.08 72.89,37.08 C54.1 | IC21.4 67.86,39 67.67,38.81 v66.45,38.81
  Bottom 0.254: v66.45,38.81 70.66,38.81 JP11.1
VI-_FIL
  Top 0.254: IC1.23 75.53,34.02 74.54,34.02 JP12.2
VI-_FIL_DAC
  Top 0.254: JP12.1 70.27,35.75 70.08,35.94 | IC21.7 69.76,37.08 69.76,36.26 70.08,35.94 | C55.1 69.09,34.95 70.08,35.94
VICM  (via drill 0.6)
  Top 0.254: IC1.40 82.91,30.17 v82.8,30.28 | JP15.2 44.3,22.35 44.81,21.84 46.84,21.84 49.68,19 49.68,17.48 51.41,15.75 51.41,15.24 TP12.TP | JP15.2 44.3,24.38 JP15.2 | IC21.3 67.22,41.62 67.46,41.86 68.89,41.86 69.09,41.66 69.13,41.62 IC21.6 69.13,38.65 67.77,37.29 66.95,37.29 v66.34,36.68
  Route2 0.254: JP15.2 44.3,23.37 44.5,23.37 46.02,21.84 68.68,21.84 75.49,28.65 81.18,28.65 v82.8,30.28 82.8,31.8 82.8,33.33 81.18,34.95 79.66,34.95 78.94,35.66 70.71,35.66 69.7,36.68 v66.34,36.68
VICM_BUFF
  Top 0.254: IC12.2 IC12.1 35.82,24.04 36.68,24.89 36.93,25.15 | 36.93,25.15 37.19,25.4 40.23,25.4 JP15.1 | C32.1 37.69,24.38 36.93,25.15
VICM_MUX
  Top 0.254: IC3.4 32.25,30.34 TP11.TP | TP11.TP 35.15,27.43 | 35.15,27.43 TP11.TP | IC12.3 34.52,27.82 TP11.TP | 35.15,27.43 44.81,27.43 46.84,25.4 JP15.3 | C47.1 32.11,26.92 33.12,27.94 TP11.TP | TP11.TP 35.15,27.94 TP11.TP
VIN_CSA
  Top 0.254: JP1.3 79.91,41.66 IC1.15 | JP10.2 JP1.3 | TP20.TP 83.92,50.8 83.21,50.09 83.21,46.53 82.6,45.92 79.35,45.92 78.74,45.31 78.74,42.88 79.5,42.11 JP1.3
VIN_CSA_1
  Top 0.254: JP9.1 74.47,44.86 74.47,45.72 | 74.47,46.67 C36.1 74.47,46.88 74.47,45.72 | IC21.9 70.4,46.42 70.71,46.74 72.24,46.74 | 72.24,46.74 73.46,46.74 74.47,45.72 | C56.1 71.81,46.3 72.24,46.74
VL_ADC  (via drill 0.6)
  Top 0.254: U$5.P$7 58.16,20.13 C21.1 C22.1 57.85,17.61 57.51,17.27 | v54.97,16.76 57,16.76 57.51,17.27 | 57.51,17.27 58.72,16.05 59.88,14.9 R7.2 | TP16.TP 111.7,32.51 C29.1 | C14.1 C8.1 98.15,18.29 98.8,18.94 IC22.P$7 | 98.65,14.94 v98.35,14.63
  Top 0.406: IC16.5 113,32.35 C29.1 111.7,32.35 v109.83,30.48 | R3.2 98.31,14.59 v98.35,14.63 97.47,15.51 C14.1
  Route3 0.406: v54.97,16.76 56.49,15.24 59.54,12.19 99.06,12.19 103.94,17.07 | v109.83,30.48 109.83,22.96 104.09,17.22 | 103.94,17.07 104.09,17.22 | 103.94,17.07 104.09,17.22 | 103.94,17.07 100.79,17.07 v98.35,14.63
VO+_BP_FIL
  Top 0.254: IC1.24 76.7,33.52 76.1,32.92 75.69,32.51 70.61,32.51 JP3.3
VO+_CH
  Top 0.254: IC1.50 88.44,30.02 88.85,30.02 JP13.3
VO+_FIL
  Top 0.254: JP3.1 73.05,25.4 75.29,27.64 77.12,27.64 77.93,28.45 77.93,30.28 78.13,30.48 78.17,30.52 IC1.30
VO-_BP_FIL  (via drill 0.6)
  Top 0.254: IC1.25 77.63,33.02 v77.12,32.51
  Bottom 0.254: v77.12,32.51 69.8,32.51 | 69.8,32.51 69.19,32.51 | JP18.3 65.84,31.19 67.16,32.51 69.8,32.51
VO-_CH
  Top 0.254: IC1.52 89.98,31.02 JP14.3
VO-_FIL  (via drill 0.6)
  Top 0.254: IC1.31 79.3,30.02 79.76,30.48 79.76,31.29 80.16,31.7 v80.77,31.7
  Bottom 0.254: JP18.1 65.84,25.3 67.36,23.77 69.6,23.77 76.3,30.48 77.52,31.7 v80.77,31.7
VOCM  (via drill 0.6)
  Top 0.254: IC1.36 80.91,29.53 80.77,29.67 80.16,29.67 79.91,29.41 IC1.34 79.91,27.99 79.55,27.64 v78.74,27.64 | TP14.TP 43.79,18.8 JP16.2
  Route2 0.254: v78.74,27.64 75.49,27.64 68.99,21.13 46.13,21.13 | 46.13,21.13 45.82,20.83 | 45.82,20.83 JP16.2 | 46.13,21.13 45.82,20.83
VOCM_1
  Top 0.254: IC2.4 29.06,45.58 | 29.06,45.58 30.44,45.58 30.99,46.13 31.53,46.13 C49.1 32.75,44.91 34.24,44.91 34.52,45.19 IC14.3 34.52,46.81 34.85,47.14 47.96,47.14 48.46,47.14 49.38,46.23 JP7.3 | TP30.TP 30.58,47.1 29.06,45.58
VOCM_BUFF
  Top 0.254: IC12.6 IC12.7 35.17,19.83 35.66,20.32 37.69,20.32 38.54,20.32 39.39,19.48 | JP16.1 39.56,19.3 39.39,19.48 | C33.1 39.22,19.3 39.39,19.48
VOCM_MUX
  Top 0.254: JP16.3 45.21,20.93 45.01,21.13 34.44,21.13 33.87,20.56 33.87,20.05 IC12.5 32.42,19.11 31.6,18.29 | IC4.4 27.43,16.15 TP13.TP 31.6,18.29 | C48.1 31.6,18.96 31.6,18.29
VOUT_CSA
  Top 0.254: IC1.54 88.72,32.02 89.2,32.51 96.32,32.51 97.33,31.5 97.33,30.79 JP19.3 98.76,29.36 TP9.TP
VSS  (via drill 0.6)
  Top 0.254: IC12.4 33.87,24.14 v33.12,24.89 | v33.63,48.26 33.63,46.31 IC14.4
  Top 0.508: TP39.TP 11.08,59.13 7.21,59.13 JP17.4
  Route3 0.508: 29.82,44.96 29.57,45.21 23.47,45.21 12.29,56.39 9.55,59.13 JP17.4 | 29.82,44.96 32.61,42.16 32.61,25.4 v33.12,24.89 | v33.63,48.26 33.12,48.26 29.82,44.96

### Text on the board
tNames: TP44 | C43 | C44 | C45 | C46 | TP2 | TP1 | TP5 | TP6 | WAC v08 | JP5 | VDD1 | TP45 | IC-UC | JP8 | JP17 | VDD2 | TP3 | 17/04/2015 | GND | TP4 | VSS | JP2 | TP18 | TP31 | JP6 | TP19 | TP39 | TP28 | C28 | TP41 | TP29 | TP30 | C4 | C57 | IC8 | JP4 | TP15 | TP20 | C26 | IC18 | C39 | C37 | TP23 | IC5 | C53 | C36 | C38 | C49 | C49 | C34 | C52 | JP7 | TP21 | IC13 | TP27 | C56 | C7 | C41 | C3 | TP37 | IC23 | JP9 | JP10 | JP1 | TP42 | C54 | TP7 | TP24 | TP34 | TP23 | TP8 | C6 | C9 | C10 | JP11 | C27 | IC19 | TP17 | C5 | C55 | TP16 | JP12 | TP10 | C29 | IC6 | TP38 | JP14 | C25 | C30 | C40 | TP11 | IC17 | C31 | IC10 | C24 | JP13 | IC16 | C1 | C13 | C12 | C11 | JP19 | TP9 | TP25 | C23 | C18 | C32 | JP15 | R38 | R34 | R18 | R22 | C17 | TP32 | C20 | C19 | JP18 | JP3 | TP35 | R39 | R35 | R19 | R23 | C48 | C47 | JP16 | C21 | IC22 | TP33 | C35 | IC7 | IC20 | C22 | R33 | R37 | R15 | R17 | R21 | R25 | C8 | R7 | C14 | C42 | TP13 | C33 | TP36 | R32 | R36 | R14 | R16 | R20 | R24 | TP14 | TP12 | TP26 | R3 | R8 | C2 | R9
bNames: R30 | R28 | R40 | R31 | R27 | R41 | R29 | R43 | R28 | R42